# EAGLE schematic SegmentDriver (EAGLE 7.7.0)

## Sheet 1 of 10: Power
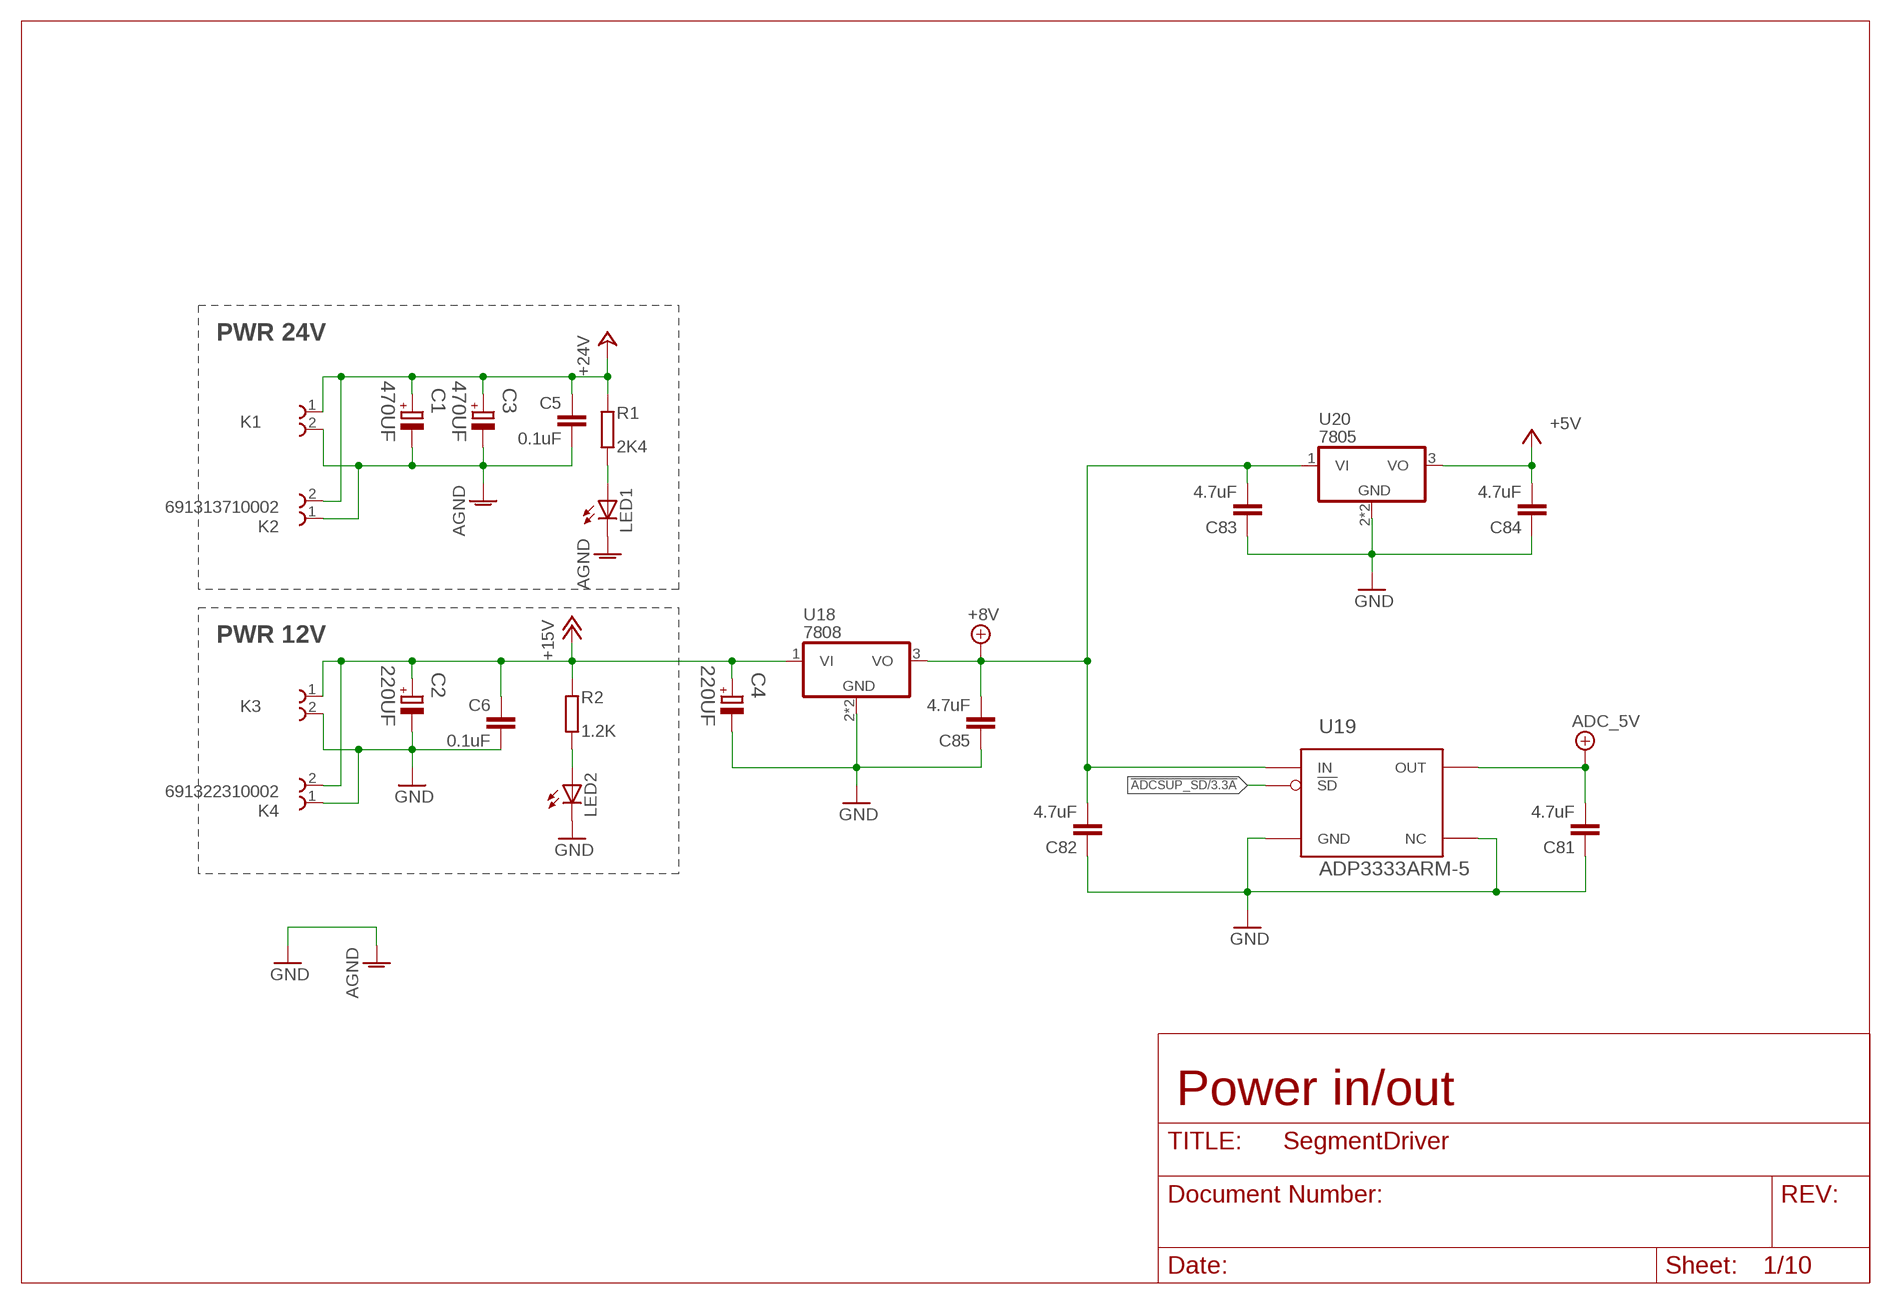
[diagram p0: schematic, sheet 1]

### Parts
C1  470UF  EEE-FK1J471AM-CASE-J16  [CAPAE1700X1700N]
C2  220UF  EEE-FP1V221AP-CASE-F  [CAPAE830X1050N]
C3  470UF  EEE-FK1J471AM-CASE-J16  [CAPAE1700X1700N]
C4  220UF  EEE-FP1V221AP-CASE-F  [CAPAE830X1050N]
C5  0.1uF  C-EUC0603K  [C0603K]
C6  0.1uF  C-EUC0603K  [C0603K]
C81  4.7uF  C-EUC0603K  [C0603K]
C82  4.7uF  C-EUC0805K  [C0805K]
C83  4.7uF  C-EUC0805K  [C0805K]
C84  4.7uF  C-EUC0603K  [C0603K]
C85  4.7uF  C-EUC0805K  [C0805K]
K1  691313710002  [691313710002]
K2  691313710002  [691313710002]
K3  691322310002  [691322310002]
K4  691322310002  [691322310002]
LED1  LEDCHIPLED_0603  [CHIPLED_0603]
LED2  LEDCHIPLED_0603  [CHIPLED_0603]
R1  2K4  R-EU_R0603  [R0603]
R2  1.2K  R-EU_R0603  [R0603]
U18  7808  78XXKTTR-D2PACK  [D2PACK/A]
U19  ADP3333ARM-5  [MSOP-8]
U20  7805  78XXKTTR-D2PACK  [D2PACK/A]

### Nets
!ADCSUP_SD: U19.7(!SD!) ; also sheet 3
+5V: C84.2 U20.3(VO) ; also sheet 2,5,9,10
+8V: C82.2 C83.2 C85.2 U18.3(VO) U19.2(IN) U20.1(VI)
+15V: C2.1 C4.1 C6.2 K3.1 K4.2 R2.2 U18.1(VI) ; also sheet 6
+24V: C1.1 C3.1 C5.2 K1.1 K2.2 R1.2 ; also sheet 6
ADC_5V: C81.2 U19.1(OUT) ; also sheet 7
AGND: C1.2 C3.2 C5.1 K1.2 K2.1 LED1.C ; also sheet 6
GND: C2.2 C4.2 C6.1 C81.1 C82.1 C83.1 C84.1 C85.1 K3.2 K4.1 LED2.C U18.2(GND) U18.TAB(GND) U19.3(GND) U19.4(NC) U19.5(NC) U19.6(NC) U19.8(NC) U20.2(GND) U20.TAB(GND) ; supply symbol labelled AGND ; also sheet 2,3,4,5,6,7,8,9,10
N$62: LED2.A R2.1
N$63: LED1.A R1.1

### Notes on the sheet
- PWR 24V
- PWR 12V
- Power in/out

## Sheet 2 of 10: Connectors
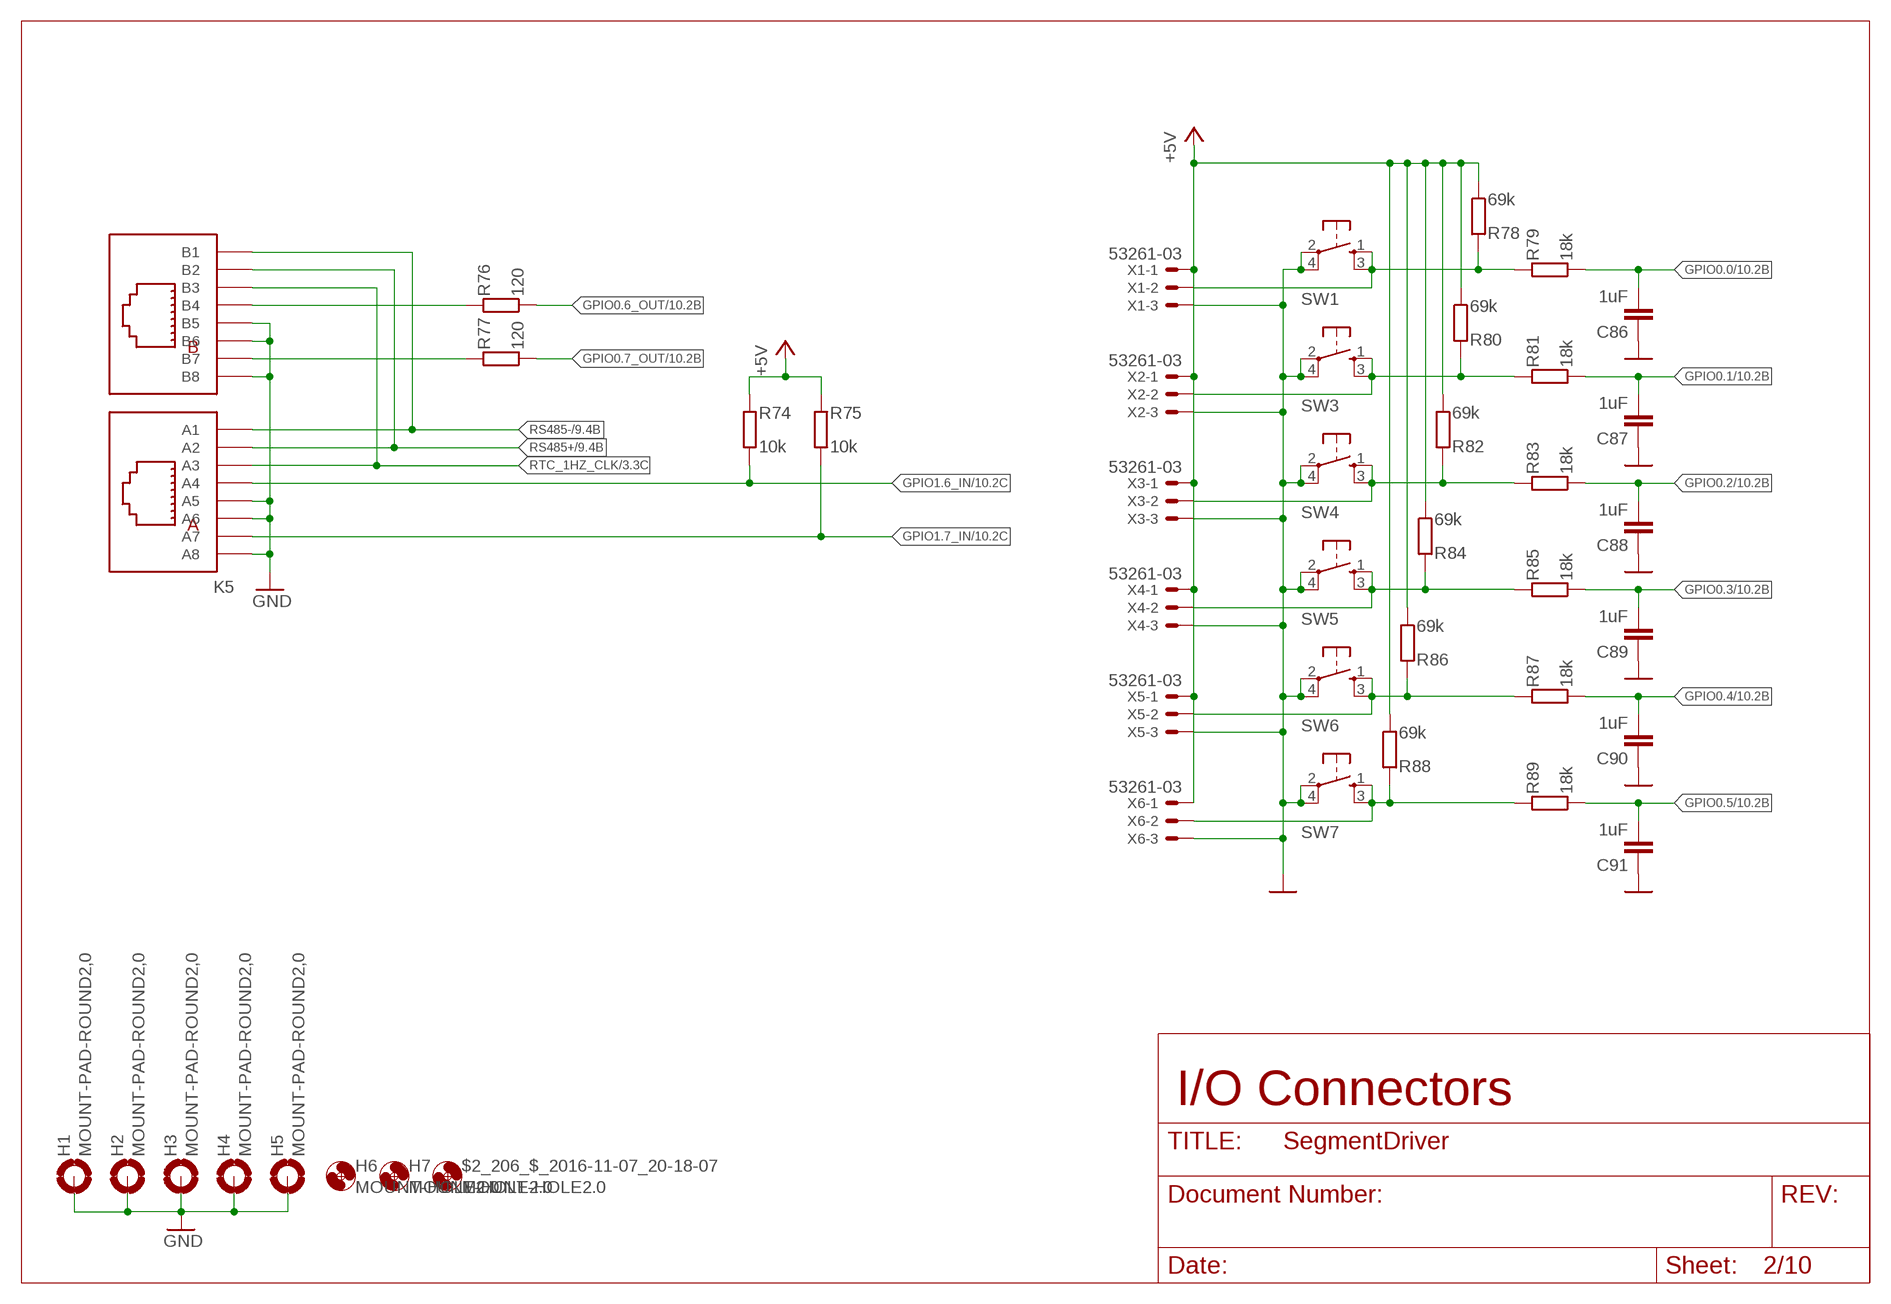
[diagram p1: schematic, sheet 2]

### Parts
$2_206_$_2016-11-07_20-18-07  MOUNT-HOLE2.0  [2,0]
C86  1uF  C-EUC0603K  [C0603K]
C87  1uF  C-EUC0603K  [C0603K]
C88  1uF  C-EUC0603K  [C0603K]
C89  1uF  C-EUC0603K  [C0603K]
C90  1uF  C-EUC0603K  [C0603K]
C91  1uF  C-EUC0603K  [C0603K]
H1  MOUNT-PAD-ROUND2,0  [2,0-PAD]
H2  MOUNT-PAD-ROUND2,0  [2,0-PAD]
H3  MOUNT-PAD-ROUND2,0  [2,0-PAD]
H4  MOUNT-PAD-ROUND2,0  [2,0-PAD]
H5  MOUNT-PAD-ROUND2,0  [2,0-PAD]
H6  MOUNT-HOLE2.0  [2,0]
H7  MOUNT-HOLE2.0  [2,0]
K5  615016149521  [615016149521]
R74  10k  R-EU_R0603  [R0603]
R75  10k  R-EU_R0603  [R0603]
R76  120  R-EU_R0603  [R0603]
R77  120  R-EU_R0603  [R0603]
R78  69k  R-EU_R0603  [R0603]
R79  18k  R-EU_R0603  [R0603]
R80  69k  R-EU_R0603  [R0603]
R81  18k  R-EU_R0603  [R0603]
R82  69k  R-EU_R0603  [R0603]
R83  18k  R-EU_R0603  [R0603]
R84  69k  R-EU_R0603  [R0603]
R85  18k  R-EU_R0603  [R0603]
R86  69k  R-EU_R0603  [R0603]
R87  18k  R-EU_R0603  [R0603]
R88  69k  R-EU_R0603  [R0603]
R89  18k  R-EU_R0603  [R0603]
SW1  434153017835_FIXED  [434153017835]
SW3  434153017835_FIXED  [434153017835]
SW4  434153017835_FIXED  [434153017835]
SW5  434153017835_FIXED  [434153017835]
SW6  434153017835_FIXED  [434153017835]
SW7  434153017835_FIXED  [434153017835]
X1  53261-03  [53261-03]
X2  53261-03  [53261-03]
X3  53261-03  [53261-03]
X4  53261-03  [53261-03]
X5  53261-03  [53261-03]
X6  53261-03  [53261-03]

### Nets
+5V: R74.2 R75.2 R78.1 R80.1 R82.1 R84.1 R86.1 R88.1 X1.1 X2.1 X3.1 X4.1 X5.1 X6.1 ; also sheet 1,5,9,10
GND: C86.1 C87.1 C88.1 C89.1 C90.1 C91.1 H1.B2,2(MOUNT) H2.B2,2(MOUNT) H3.B2,2(MOUNT) H4.B2,2(MOUNT) H5.B2,2(MOUNT) K5.A5 K5.A6 K5.A8 K5.B5 K5.B6 K5.B8 SW1.2 SW1.4 SW3.2 SW3.4 SW4.2 SW4.4 SW5.2 SW5.4 SW6.2 SW6.4 SW7.2 SW7.4 X1.3 X2.3 X3.3 X4.3 X5.3 X6.3 ; also sheet 1,3,4,5,6,7,8,9,10
GPIO0.0: C86.2 R79.1 ; also sheet 10
GPIO0.1: C87.2 R81.1 ; also sheet 10
GPIO0.2: C88.2 R83.1 ; also sheet 10
GPIO0.3: C89.2 R85.1 ; also sheet 10
GPIO0.4: C90.2 R87.1 ; also sheet 10
GPIO0.5: C91.2 R89.1 ; also sheet 10
GPIO0.6_OUT: R76.1 ; also sheet 10
GPIO0.7_OUT: R77.1 ; also sheet 10
GPIO1.6_IN: K5.A4 R74.1 ; also sheet 10
GPIO1.7_IN: K5.A7 R75.1 ; also sheet 10
GPIO6_OUT: K5.B4 R76.2
GPIO7_OUT: K5.B7 R77.2
N$64: R78.2 R79.2 SW1.1 SW1.3 X1.2
N$66: R80.2 R81.2 SW3.1 SW3.3 X2.2
N$68: R82.2 R83.2 SW4.1 SW4.3 X3.2
N$70: R84.2 R85.2 SW5.1 SW5.3 X4.2
N$72: R86.2 R87.2 SW6.1 SW6.3 X5.2
N$79: R88.2 R89.2 SW7.1 SW7.3 X6.2
RS485+: K5.A2 K5.B2 ; also sheet 9
RS485-: K5.A1 K5.B1 ; also sheet 9
RTC_1HZ_CLK: K5.A3 K5.B3 ; also sheet 3,4

### Notes on the sheet
- I/O Connectors

## Sheet 3 of 10: MCU
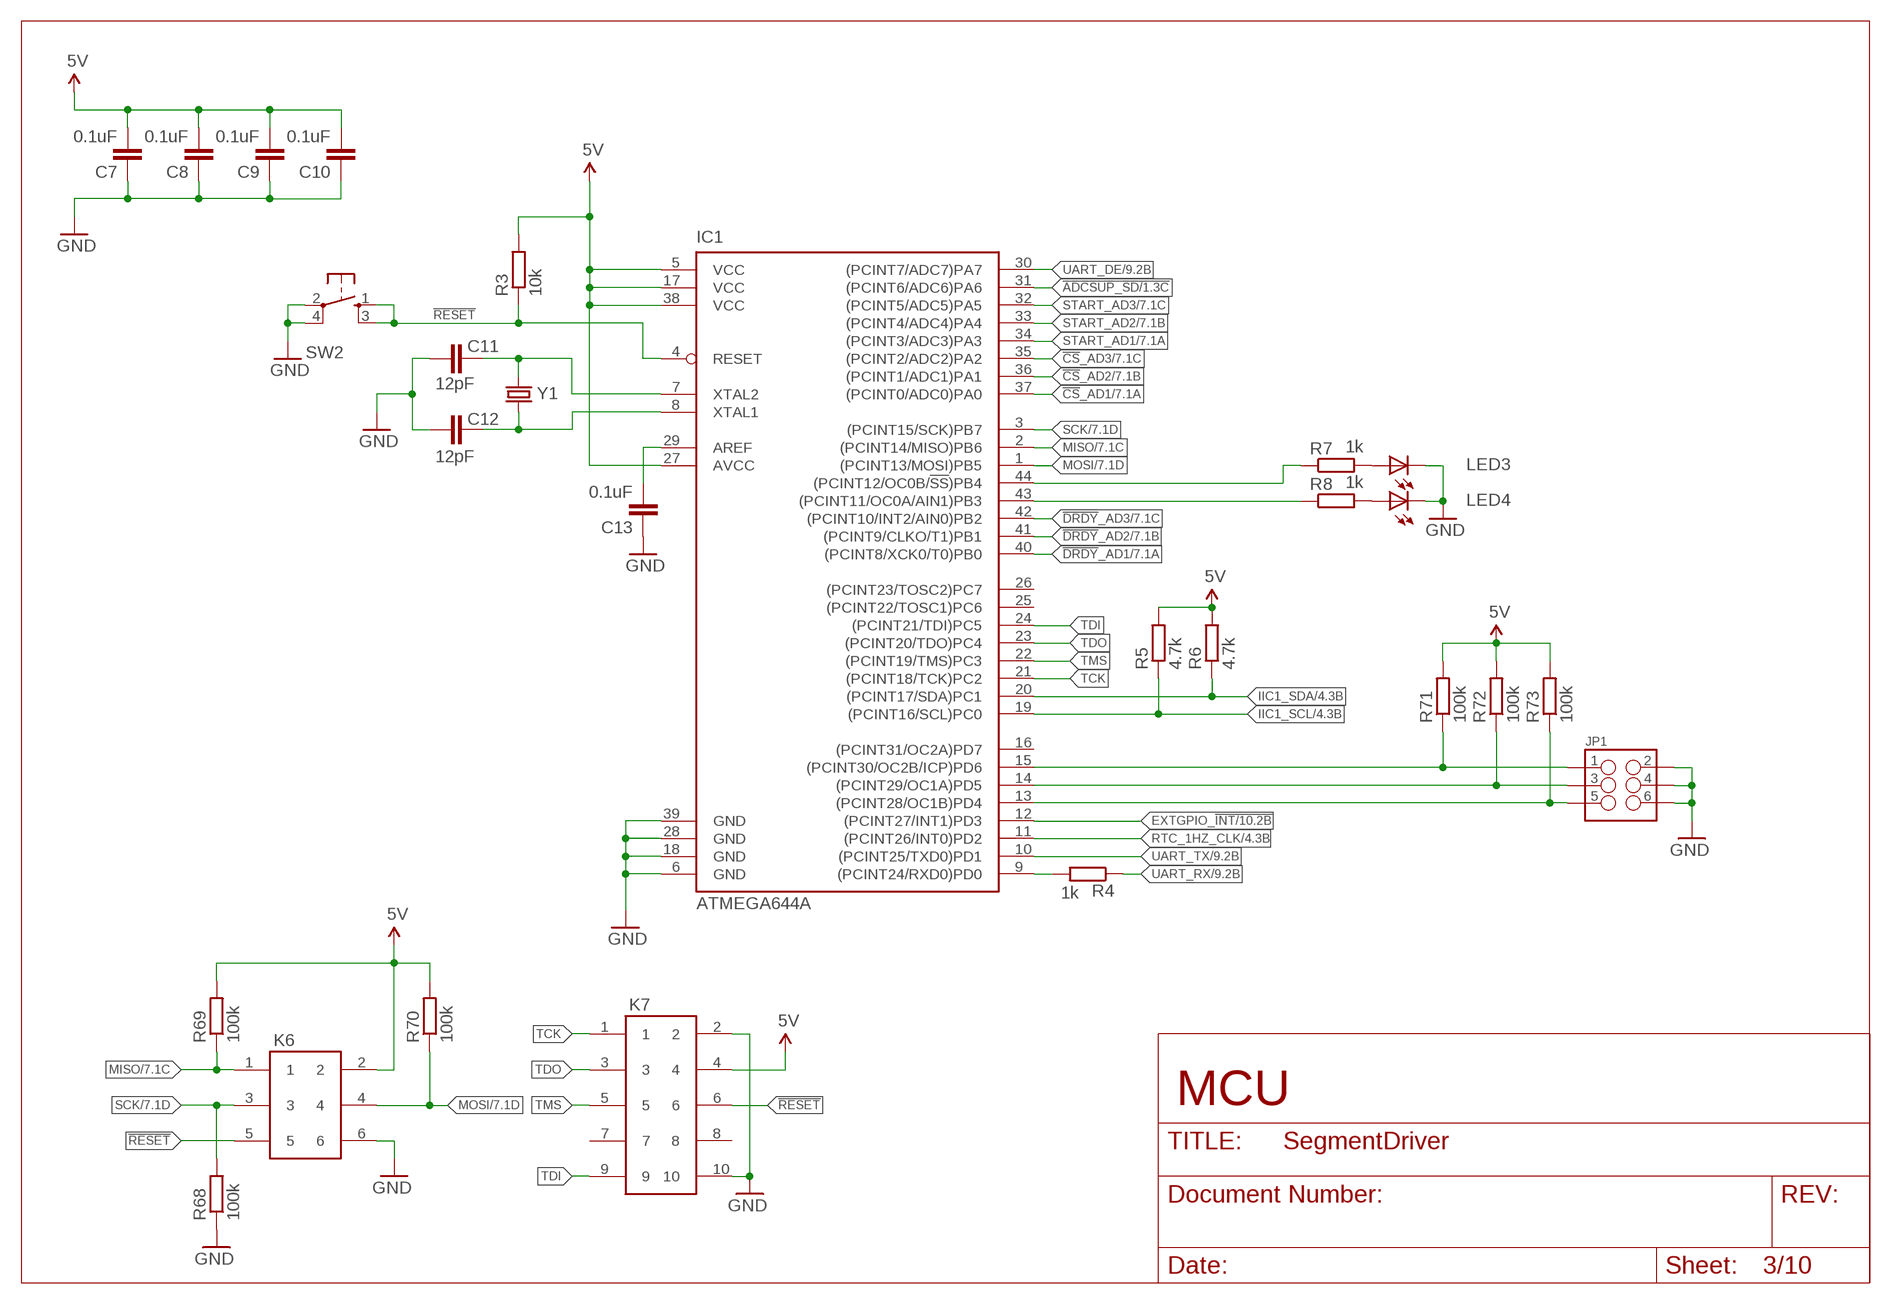
[diagram p2: schematic, sheet 3]

### Parts
C7  0.1uF  C-EUC0603K  [C0603K]
C8  0.1uF  C-EUC0603K  [C0603K]
C9  0.1uF  C-EUC0603K  [C0603K]
C10  0.1uF  C-EUC0603K  [C0603K]
C11  12pF  C-EUC0603K  [C0603K]
C12  12pF  C-EUC0603K  [C0603K]
C13  0.1uF  C-EUC0603K  [C0603K]
IC1  ATMEGA644A  [TQFP44]
JP1  M03X22X3_SILK_SM  [2X3]
K6  61200621621  [61200621621]
K7  61201021621  [61201021621]
LED3  LEDCHIPLED_0603  [CHIPLED_0603]
LED4  LEDCHIPLED_0603  [CHIPLED_0603]
R3  10k  R-EU_R0603  [R0603]
R4  1k  R-EU_R0603  [R0603]
R5  4.7k  R-EU_R0603  [R0603]
R6  4.7k  R-EU_R0603  [R0603]
R7  1k  R-EU_R0603  [R0603]
R8  1k  R-EU_R0603  [R0603]
R68  100k  R-EU_R0603  [R0603]
R69  100k  R-EU_R0603  [R0603]
R70  100k  R-EU_R0603  [R0603]
R71  100k  R-EU_R0603  [R0603]
R72  100k  R-EU_R0603  [R0603]
R73  100k  R-EU_R0603  [R0603]
SW2  434153017835_FIXED  [434153017835]
Y1  CRYSTAL5X3  [CRYSTAL-SMD-5X3]

### Nets
5V: C7.2 C8.2 C9.2 C10.2 IC1.5(VCC) IC1.17(VCC) IC1.27(AVCC) IC1.38(VCC) K6.2 K7.4 R3.2 R5.2 R6.2 R69.2 R70.2 R71.2 R72.2 R73.2 ; also sheet 4
!ADCSUP_SD: IC1.31((PCINT6/ADC6)PA6) ; also sheet 1
!CS!_AD1: IC1.37((PCINT0/ADC0)PA0) ; also sheet 7
!CS!_AD2: IC1.36((PCINT1/ADC1)PA1) ; also sheet 7
!CS!_AD3: IC1.35((PCINT2/ADC2)PA2) ; also sheet 7
!DRDY!_AD1: IC1.40((PCINT8/XCK0/T0)PB0) ; also sheet 7
!DRDY!_AD2: IC1.41((PCINT9/CLKO/T1)PB1) ; also sheet 7
!DRDY!_AD3: IC1.42((PCINT10/INT2/AIN0)PB2) ; also sheet 7
!RESET: IC1.4(RESET) K6.5 K7.6 R3.1 SW2.1 SW2.3
EXTGPIO_!INT: IC1.12((PCINT27/INT1)PD3) ; also sheet 10
GND: C7.1 C8.1 C9.1 C10.1 C11.2 C12.2 C13.1 IC1.6(GND) IC1.18(GND) IC1.28(GND) IC1.39(GND) JP1.2 JP1.4 JP1.6 K6.6 K7.2 K7.10 LED3.C LED4.C R68.1 SW2.2 SW2.4 ; also sheet 1,2,4,5,6,7,8,9,10
IIC1_SCL: IC1.19((PCINT16/SCL)PC0) R5.1 ; also sheet 4,5,10
IIC1_SDA: IC1.20((PCINT17/SDA)PC1) R6.1 ; also sheet 4,5,10
LED1: IC1.44((PCINT12/OC0B/!SS!)PB4) R7.1
MISO: IC1.2((PCINT14/MISO)PB6) K6.1 R69.1 ; also sheet 7
MOSI: IC1.1((PCINT13/MOSI)PB5) K6.4 R70.1 ; also sheet 7
N$29: C13.2 IC1.29(AREF)
N$32: LED4.A R8.2
N$33: LED3.A R7.2
N$39: C12.1 IC1.8(XTAL1) Y1.1
N$40: C11.1 IC1.7(XTAL2) Y1.3
N$47: IC1.9((PCINT24/RXD0)PD0) R4.2
N$56: IC1.13((PCINT28/OC1B)PD4) JP1.5 R73.1
N$57: IC1.14((PCINT29/OC1A)PD5) JP1.3 R72.1
N$58: IC1.15((PCINT30/OC2B/ICP)PD6) JP1.1 R71.1
N$59: IC1.43((PCINT11/OC0A/AIN1)PB3) R8.1
RTC_1HZ_CLK: IC1.11((PCINT26/INT0)PD2) ; also sheet 2,4
SCK: IC1.3((PCINT15/SCK)PB7) K6.3 R68.2 ; also sheet 7
START_AD1: IC1.34((PCINT3/ADC3)PA3) ; also sheet 7
START_AD2: IC1.33((PCINT4/ADC4)PA4) ; also sheet 7
START_AD3: IC1.32((PCINT5/ADC5)PA5) ; also sheet 7
TCK: IC1.21((PCINT18/TCK)PC2) K7.1
TDI: IC1.24((PCINT21/TDI)PC5) K7.9
TDO: IC1.23((PCINT20/TDO)PC4) K7.3
TMS: IC1.22((PCINT19/TMS)PC3) K7.5
UART_DE: IC1.30((PCINT7/ADC7)PA7) ; also sheet 9
UART_RX: R4.1 ; also sheet 9
UART_TX: IC1.10((PCINT25/TXD0)PD1) ; also sheet 9
Unconnected: IC1.16((PCINT31/OC2A)PD7) IC1.25((PCINT22/TOSC1)PC6) IC1.26((PCINT23/TOSC2)PC7) K7.7 K7.8

### Notes on the sheet
- MCU

## Sheet 4 of 10: RTC
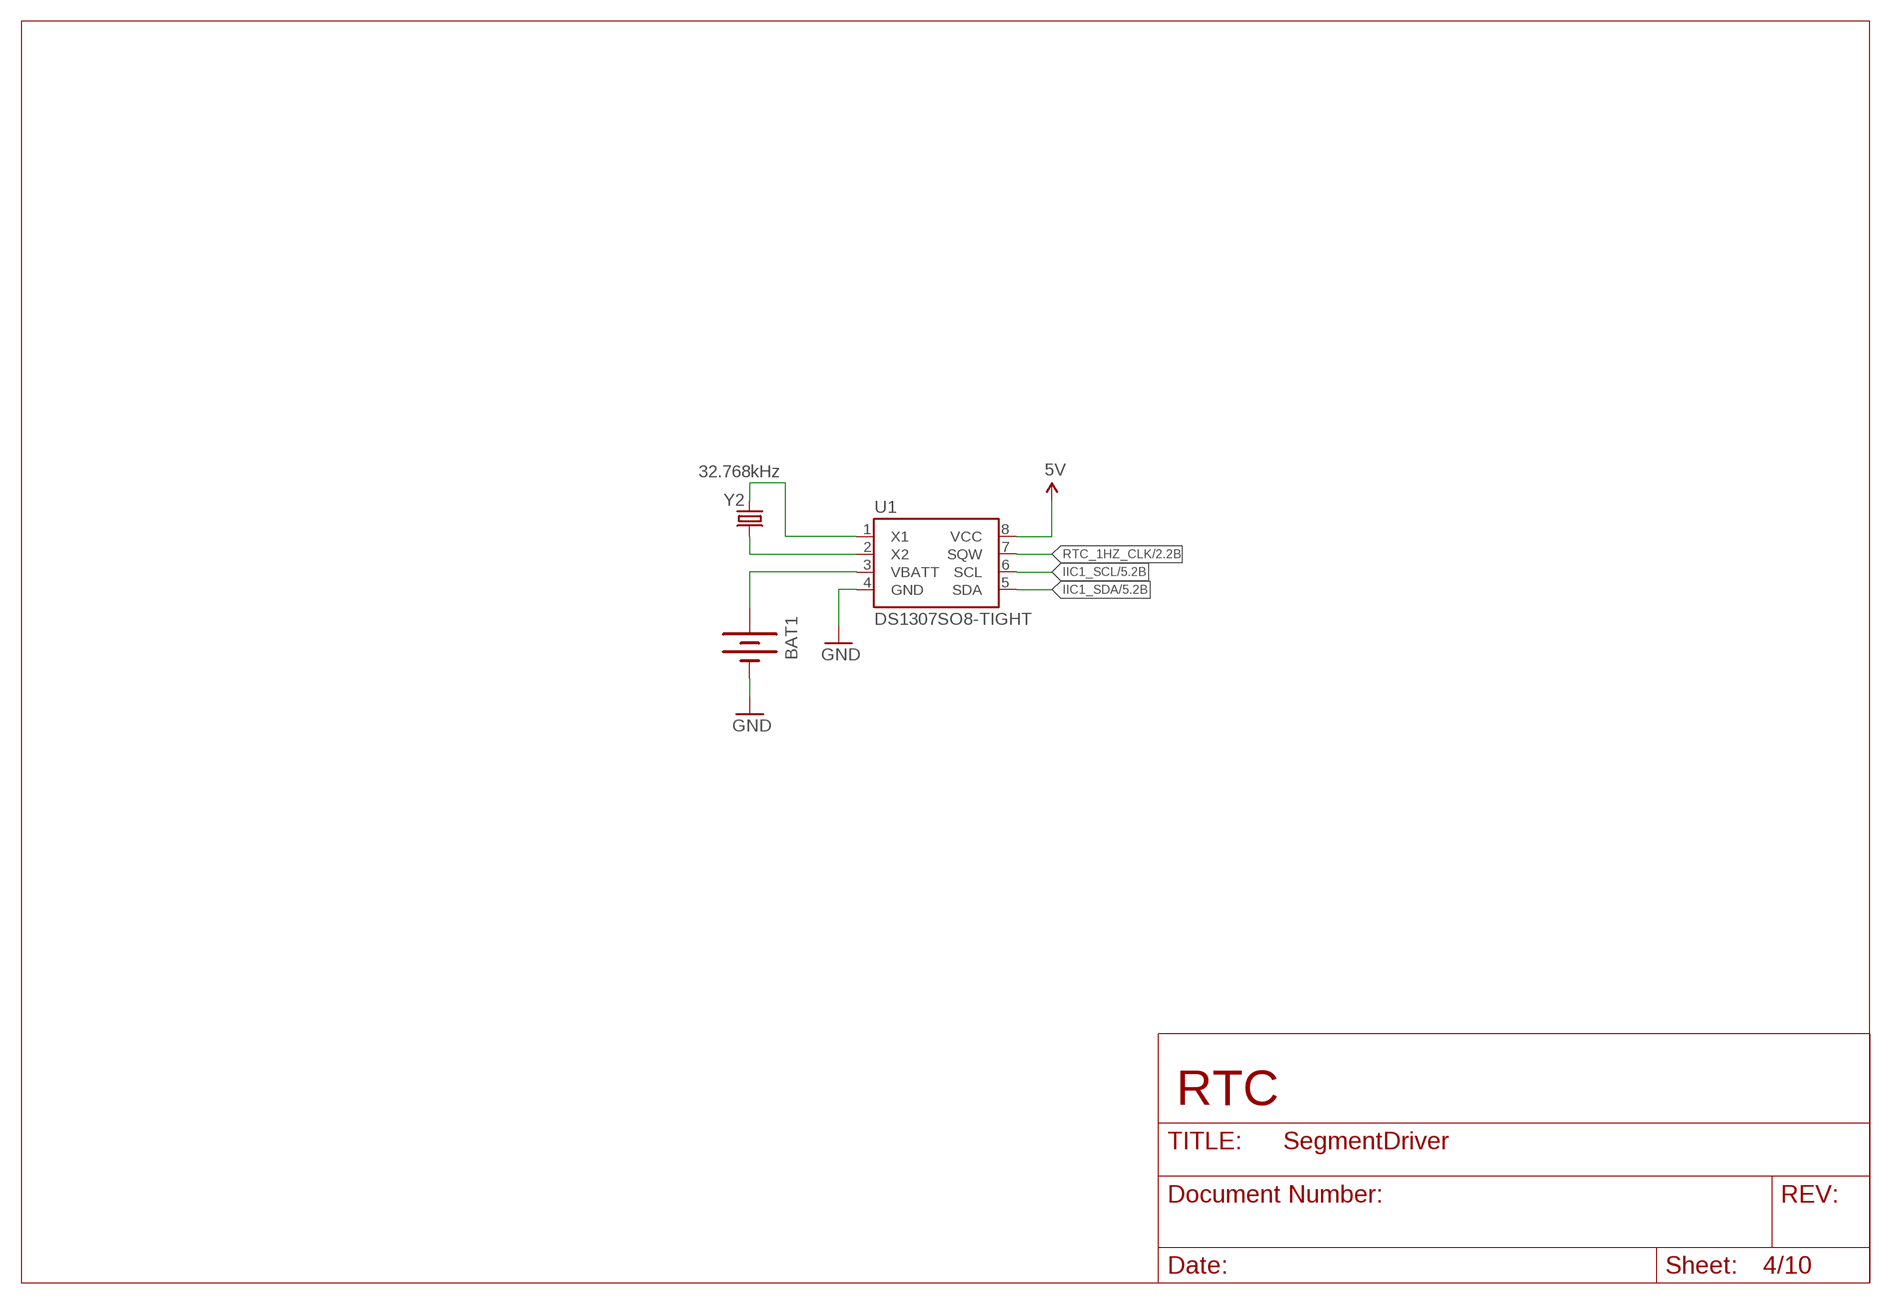
[diagram p3: schematic, sheet 4]

### Parts
BAT1  BATTERY-79528211  [79528211]
U1  DS1307SO8-TIGHT  [SO08-TIGHT]
Y2  32.768kHz  CRYSTALEPSONMC146  [CRYSTAL-32KHZ-SMD_EPSON_MC146]

### Nets
5V: U1.8(VCC) ; also sheet 3
GND: BAT1.- U1.4(GND) ; also sheet 1,2,3,5,6,7,8,9,10
IIC1_SCL: U1.6(SCL) ; also sheet 3,5,10
IIC1_SDA: U1.5(SDA) ; also sheet 3,5,10
N$21: U1.2(X2) Y2.P$2
N$24: BAT1.+ U1.3(VBATT)
RTC_1HZ_CLK: U1.7(SQW) ; also sheet 2,3
X1: U1.1(X1) Y2.P$1

### Notes on the sheet
- RTC

## Sheet 5 of 10: Heater PWM control
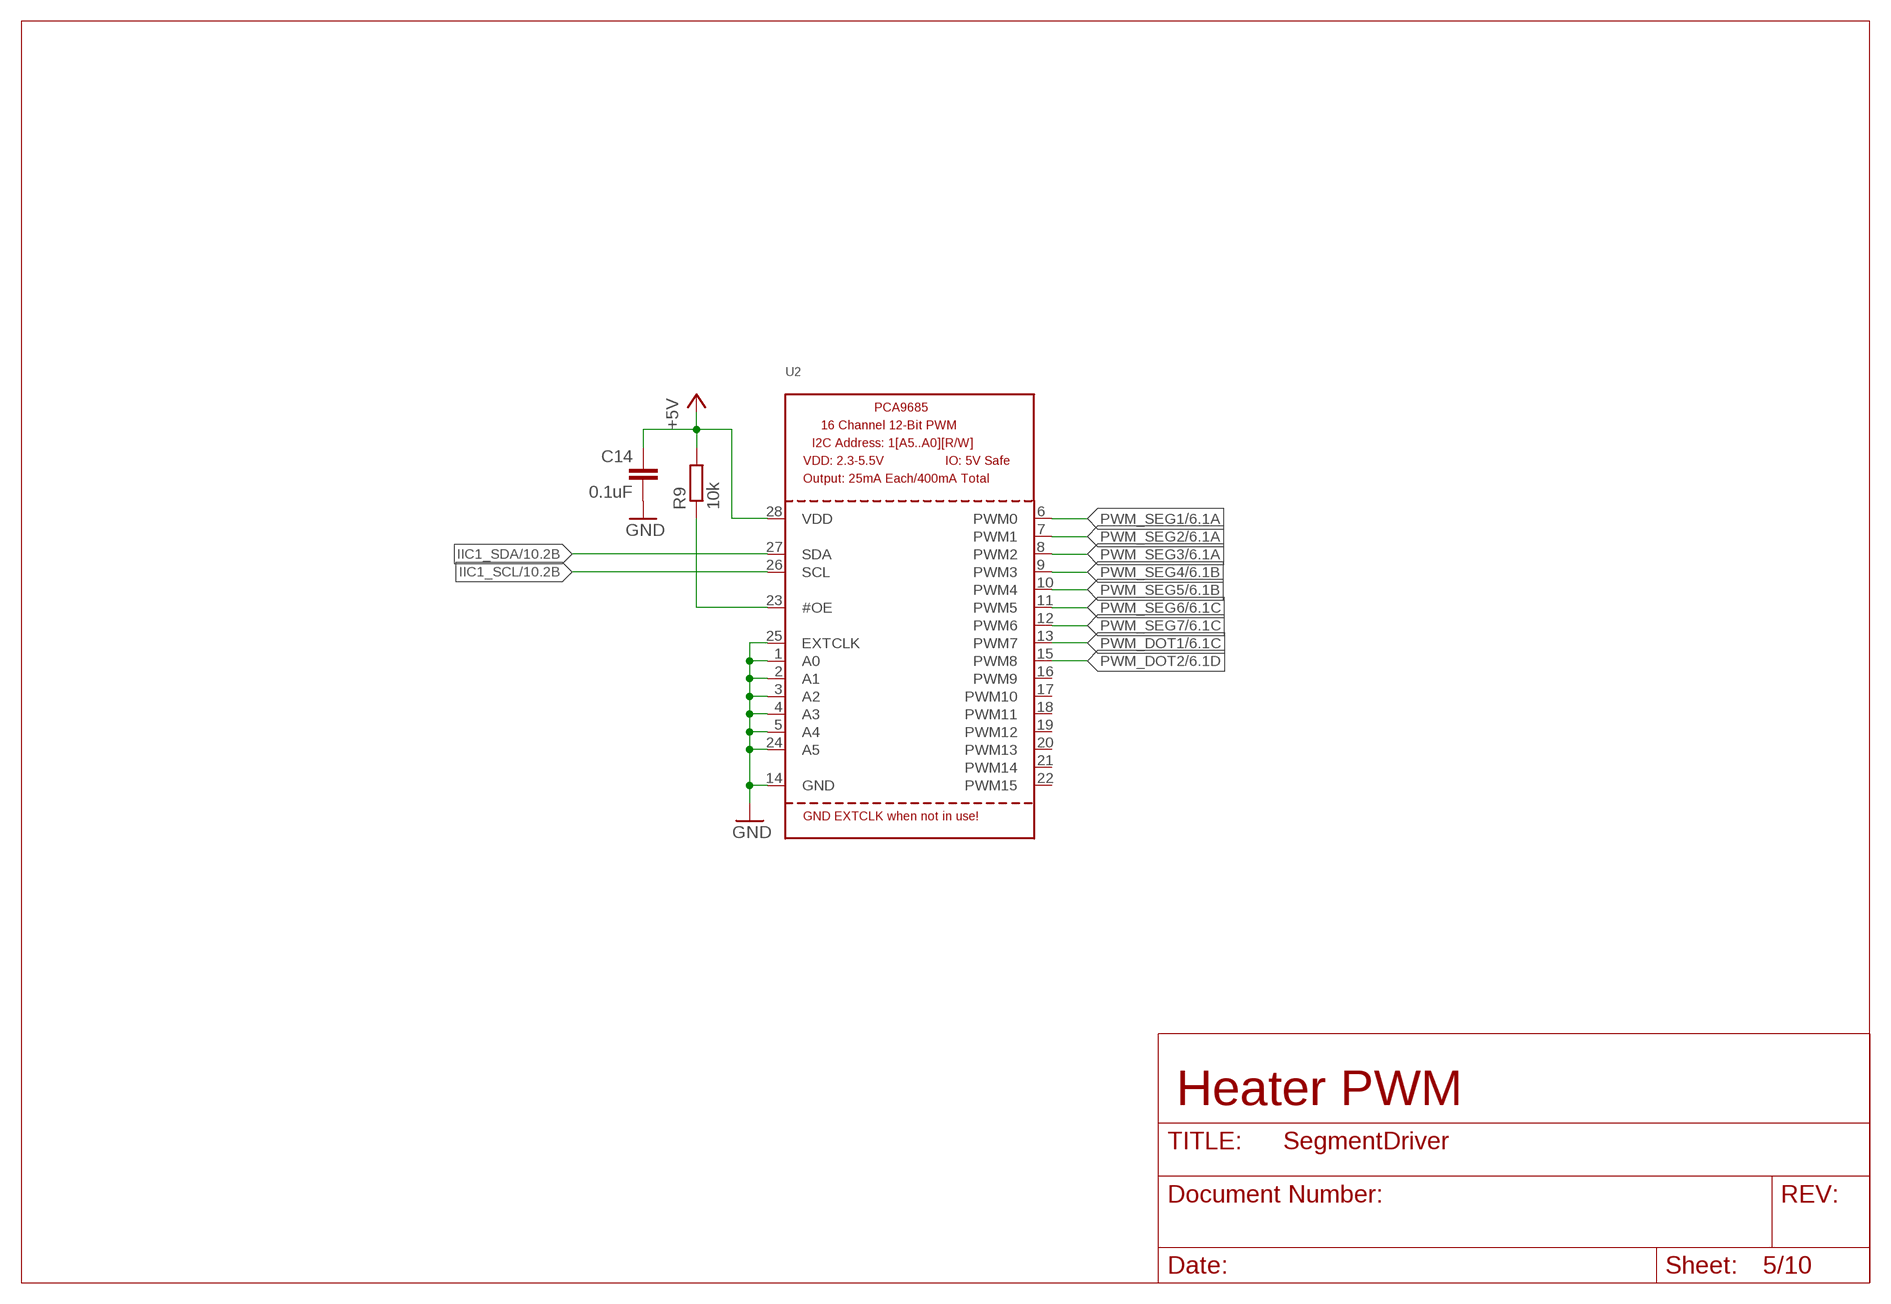
[diagram p4: schematic, sheet 5]

### Parts
C14  0.1uF  C-EUC0603K  [C0603K]
R9  10k  R-EU_R0603  [R0603]
U2  PCA9685  [TSSOP28]

### Nets
+5V: C14.1 R9.2 U2.28(VDD) ; also sheet 1,2,9,10
GND: C14.2 U2.1(A0) U2.2(A1) U2.3(A2) U2.4(A3) U2.5(A4) U2.14(GND) U2.24(A5) U2.25(EXTCLK) ; also sheet 1,2,3,4,6,7,8,9,10
IIC1_SCL: U2.26(SCL) ; also sheet 3,4,10
IIC1_SDA: U2.27(SDA) ; also sheet 3,4,10
N$5: R9.1 U2.23(#OE)
PWM_DOT1: U2.13(PWM7) ; also sheet 6
PWM_DOT2: U2.15(PWM8) ; also sheet 6
PWM_SEG1: U2.6(PWM0) ; also sheet 6
PWM_SEG2: U2.7(PWM1) ; also sheet 6
PWM_SEG3: U2.8(PWM2) ; also sheet 6
PWM_SEG4: U2.9(PWM3) ; also sheet 6
PWM_SEG5: U2.10(PWM4) ; also sheet 6
PWM_SEG6: U2.11(PWM5) ; also sheet 6
PWM_SEG7: U2.12(PWM6) ; also sheet 6
Unconnected: U2.16(PWM9) U2.17(PWM10) U2.18(PWM11) U2.19(PWM12) U2.20(PWM13) U2.21(PWM14) U2.22(PWM15)

### Notes on the sheet
- Heater PWM

## Sheet 6 of 10: Segment heaters
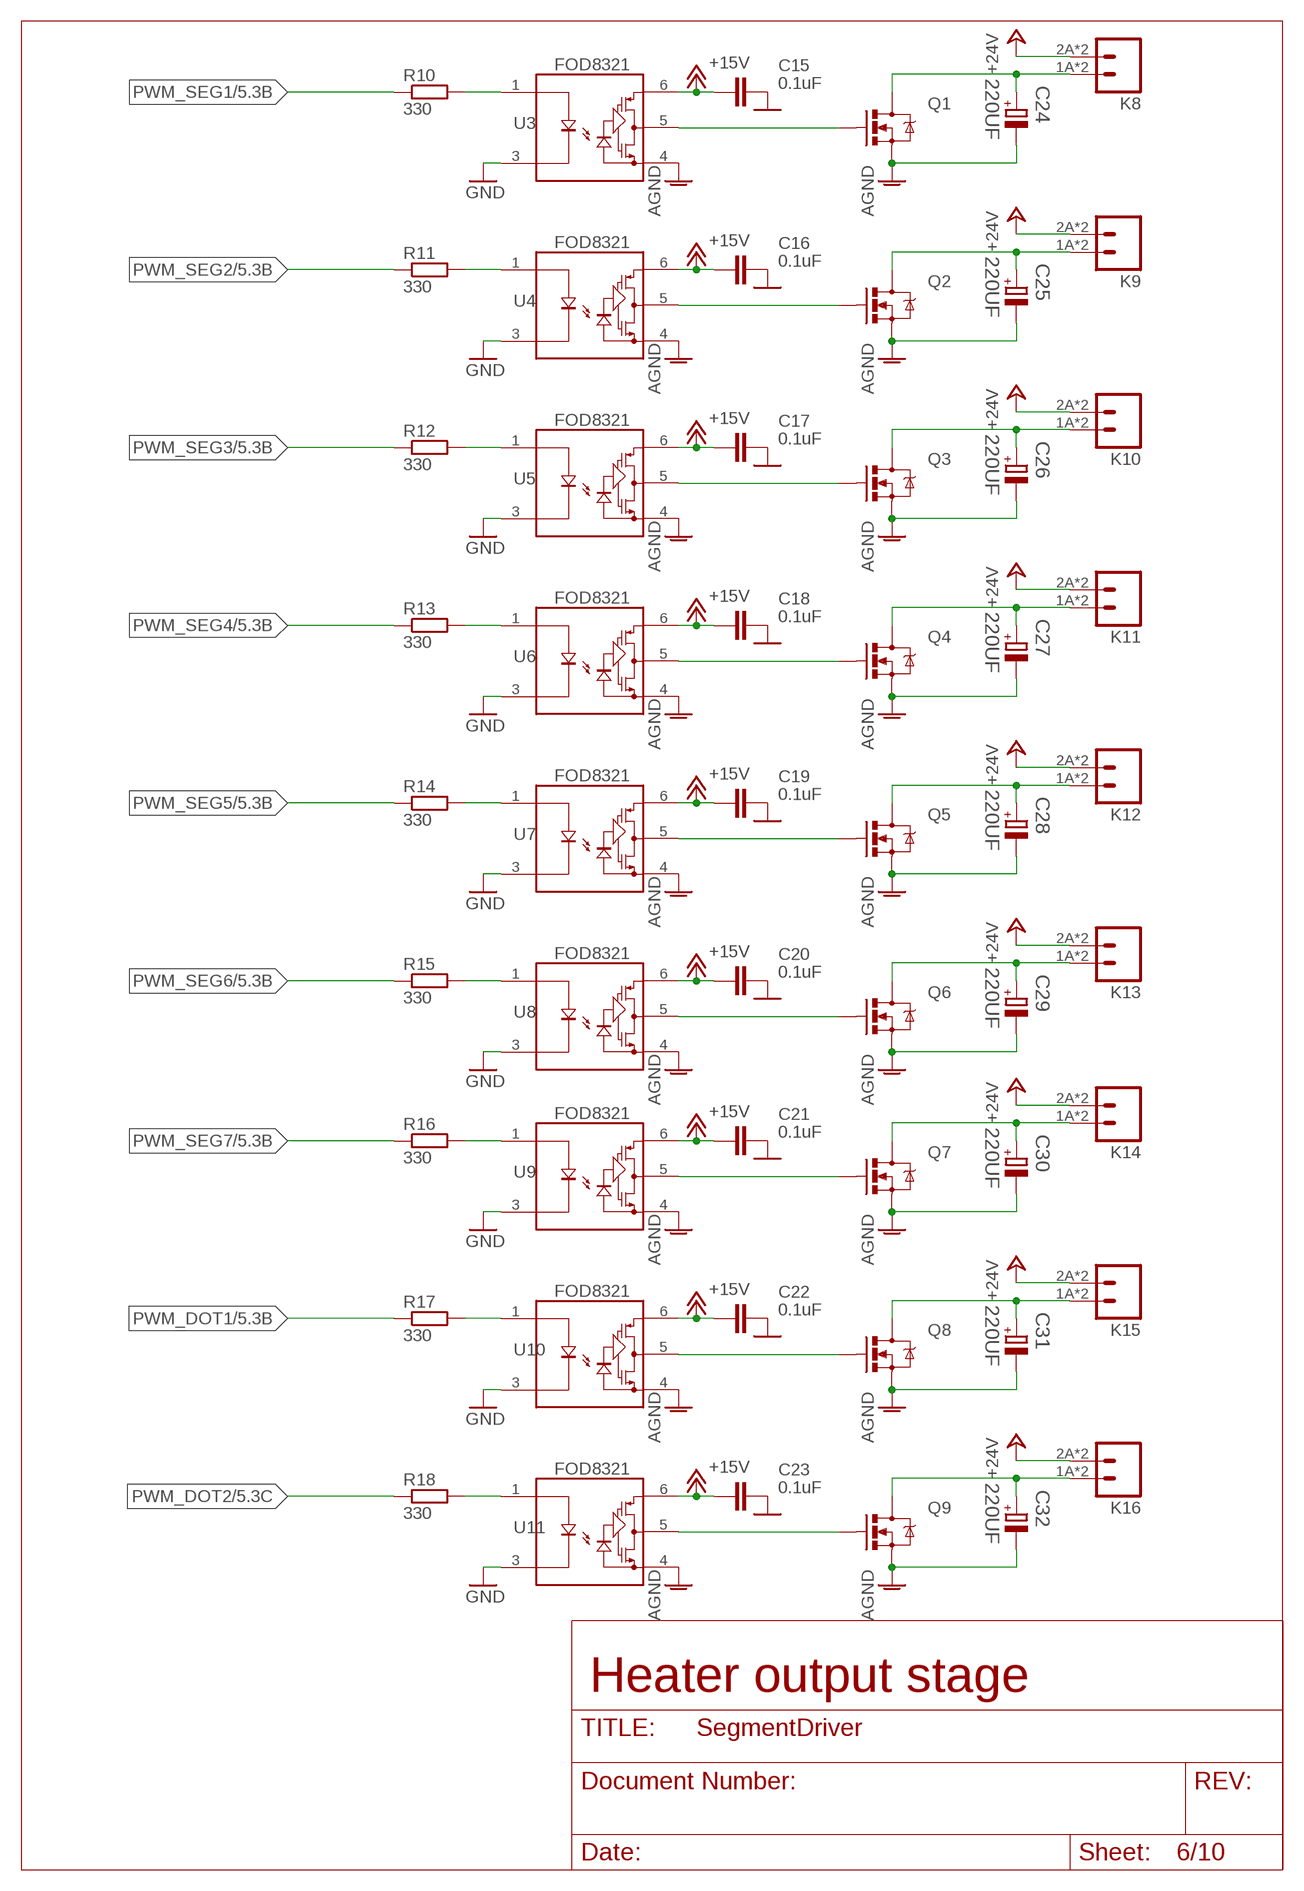
[diagram p5: schematic, sheet 6]

### Parts
C15  0.1uF  C-EUC1206K  [C1206K]
C16  0.1uF  C-EUC1206K  [C1206K]
C17  0.1uF  C-EUC1206K  [C1206K]
C18  0.1uF  C-EUC1206K  [C1206K]
C19  0.1uF  C-EUC1206K  [C1206K]
C20  0.1uF  C-EUC1206K  [C1206K]
C21  0.1uF  C-EUC1206K  [C1206K]
C22  0.1uF  C-EUC1206K  [C1206K]
C23  0.1uF  C-EUC1206K  [C1206K]
C24  220UF  EEE-FK1J221AQ-CASE-H13  [CAPAE1350X1400N]
C25  220UF  EEE-FK1J221AQ-CASE-H13  [CAPAE1350X1400N]
C26  220UF  EEE-FK1J221AQ-CASE-H13  [CAPAE1350X1400N]
C27  220UF  EEE-FK1J221AQ-CASE-H13  [CAPAE1350X1400N]
C28  220UF  EEE-FK1J221AQ-CASE-H13  [CAPAE1350X1400N]
C29  220UF  EEE-FK1J221AQ-CASE-H13  [CAPAE1350X1400N]
C30  220UF  EEE-FK1J221AQ-CASE-H13  [CAPAE1350X1400N]
C31  220UF  EEE-FK1J221AQ-CASE-H13  [CAPAE1350X1400N]
C32  220UF  EEE-FK1J221AQ-CASE-H13  [CAPAE1350X1400N]
K8  M02-MOLEX-104188-0210  [LITE-TRAP-CONNECTOR-2]
K9  M02-MOLEX-104188-0210  [LITE-TRAP-CONNECTOR-2]
K10  M02-MOLEX-104188-0210  [LITE-TRAP-CONNECTOR-2]
K11  M02-MOLEX-104188-0210  [LITE-TRAP-CONNECTOR-2]
K12  M02-MOLEX-104188-0210  [LITE-TRAP-CONNECTOR-2]
K13  M02-MOLEX-104188-0210  [LITE-TRAP-CONNECTOR-2]
K14  M02-MOLEX-104188-0210  [LITE-TRAP-CONNECTOR-2]
K15  M02-MOLEX-104188-0210  [LITE-TRAP-CONNECTOR-2]
K16  M02-MOLEX-104188-0210  [LITE-TRAP-CONNECTOR-2]
Q1  MOSFET-NCHANNEL-FDMS5672  [POWERPACK5060-8]
Q2  MOSFET-NCHANNEL-FDMS5672  [POWERPACK5060-8]
Q3  MOSFET-NCHANNEL-FDMS5672  [POWERPACK5060-8]
Q4  MOSFET-NCHANNEL-FDMS5672  [POWERPACK5060-8]
Q5  MOSFET-NCHANNEL-FDMS5672  [POWERPACK5060-8]
Q6  MOSFET-NCHANNEL-FDMS5672  [POWERPACK5060-8]
Q7  MOSFET-NCHANNEL-FDMS5672  [POWERPACK5060-8]
Q8  MOSFET-NCHANNEL-FDMS5672  [POWERPACK5060-8]
Q9  MOSFET-NCHANNEL-FDMS5672  [POWERPACK5060-8]
R10  330  R-EU_R0603  [R0603]
R11  330  R-EU_R0603  [R0603]
R12  330  R-EU_R0603  [R0603]
R13  330  R-EU_R0603  [R0603]
R14  330  R-EU_R0603  [R0603]
R15  330  R-EU_R0603  [R0603]
R16  330  R-EU_R0603  [R0603]
R17  330  R-EU_R0603  [R0603]
R18  330  R-EU_R0603  [R0603]
U3  FOD8321  [WB-SOP5]
U4  FOD8321  [WB-SOP5]
U5  FOD8321  [WB-SOP5]
U6  FOD8321  [WB-SOP5]
U7  FOD8321  [WB-SOP5]
U8  FOD8321  [WB-SOP5]
U9  FOD8321  [WB-SOP5]
U10  FOD8321  [WB-SOP5]
U11  FOD8321  [WB-SOP5]

### Nets
+15V: C15.1 C16.1 C17.1 C18.1 C19.1 C20.1 C21.1 C22.1 C23.1 U3.6(VDD) U4.6(VDD) U5.6(VDD) U6.6(VDD) U7.6(VDD) U8.6(VDD) U9.6(VDD) U10.6(VDD) U11.6(VDD) ; also sheet 1
+24V: K8.2A K8.2B K9.2A K9.2B K10.2A K10.2B K11.2A K11.2B K12.2A K12.2B K13.2A K13.2B K14.2A K14.2B K15.2A K15.2B K16.2A K16.2B ; also sheet 1
AGND: C24.2 C25.2 C26.2 C27.2 C28.2 C29.2 C30.2 C31.2 C32.2 Q1.S1(S) Q1.S2(S) Q1.S3(S) Q2.S1(S) Q2.S2(S) Q2.S3(S) Q3.S1(S) Q3.S2(S) Q3.S3(S) Q4.S1(S) Q4.S2(S) Q4.S3(S) Q5.S1(S) Q5.S2(S) Q5.S3(S) Q6.S1(S) Q6.S2(S) Q6.S3(S) Q7.S1(S) Q7.S2(S) Q7.S3(S) Q8.S1(S) Q8.S2(S) Q8.S3(S) Q9.S1(S) Q9.S2(S) Q9.S3(S) U3.4(VSS) U4.4(VSS) U5.4(VSS) U6.4(VSS) U7.4(VSS) U8.4(VSS) U9.4(VSS) U10.4(VSS) U11.4(VSS) ; also sheet 1
GND: C15.2 C16.2 C17.2 C18.2 C19.2 C20.2 C21.2 C22.2 C23.2 U3.3(K) U4.3(K) U5.3(K) U6.3(K) U7.3(K) U8.3(K) U9.3(K) U10.3(K) U11.3(K) ; also sheet 1,2,3,4,5,7,8,9,10
N$1: R18.2 U11.1(A)
N$2: R17.2 U10.1(A)
N$3: C24.1 K8.1A K8.1B Q1.D5(D) Q1.D6(D) Q1.D7(D) Q1.D8(D) Q1.DPAD(D)
N$4: R11.2 U4.1(A)
N$6: C25.1 K9.1A K9.1B Q2.D5(D) Q2.D6(D) Q2.D7(D) Q2.D8(D) Q2.DPAD(D)
N$7: R12.2 U5.1(A)
N$8: C26.1 K10.1A K10.1B Q3.D5(D) Q3.D6(D) Q3.D7(D) Q3.D8(D) Q3.DPAD(D)
N$9: R13.2 U6.1(A)
N$10: R10.2 U3.1(A)
N$11: C27.1 K11.1A K11.1B Q4.D5(D) Q4.D6(D) Q4.D7(D) Q4.D8(D) Q4.DPAD(D)
N$12: R14.2 U7.1(A)
N$13: C28.1 K12.1A K12.1B Q5.D5(D) Q5.D6(D) Q5.D7(D) Q5.D8(D) Q5.DPAD(D)
N$14: R15.2 U8.1(A)
N$15: C29.1 K13.1A K13.1B Q6.D5(D) Q6.D6(D) Q6.D7(D) Q6.D8(D) Q6.DPAD(D)
N$16: R16.2 U9.1(A)
N$17: C30.1 K14.1A K14.1B Q7.D5(D) Q7.D6(D) Q7.D7(D) Q7.D8(D) Q7.DPAD(D)
N$18: C31.1 K15.1A K15.1B Q8.D5(D) Q8.D6(D) Q8.D7(D) Q8.D8(D) Q8.DPAD(D)
N$19: C32.1 K16.1A K16.1B Q9.D5(D) Q9.D6(D) Q9.D7(D) Q9.D8(D) Q9.DPAD(D)
PWM_DOT1: R17.1 ; also sheet 5
PWM_DOT2: R18.1 ; also sheet 5
PWM_SEG1: R10.1 ; also sheet 5
PWM_SEG2: R11.1 ; also sheet 5
PWM_SEG3: R12.1 ; also sheet 5
PWM_SEG4: R13.1 ; also sheet 5
PWM_SEG5: R14.1 ; also sheet 5
PWM_SEG6: R15.1 ; also sheet 5
PWM_SEG7: R16.1 ; also sheet 5
VO: Q1.G4(G) U3.5(VO)
VO1: Q2.G4(G) U4.5(VO)
VO2: Q3.G4(G) U5.5(VO)
VO3: Q4.G4(G) U6.5(VO)
VO4: Q5.G4(G) U7.5(VO)
VO5: Q6.G4(G) U8.5(VO)
VO6: Q7.G4(G) U9.5(VO)
VO7: Q9.G4(G) U11.5(VO)
VO8: Q8.G4(G) U10.5(VO)

### Notes on the sheet
- Heater output stage

## Sheet 7 of 10: RTD ADS
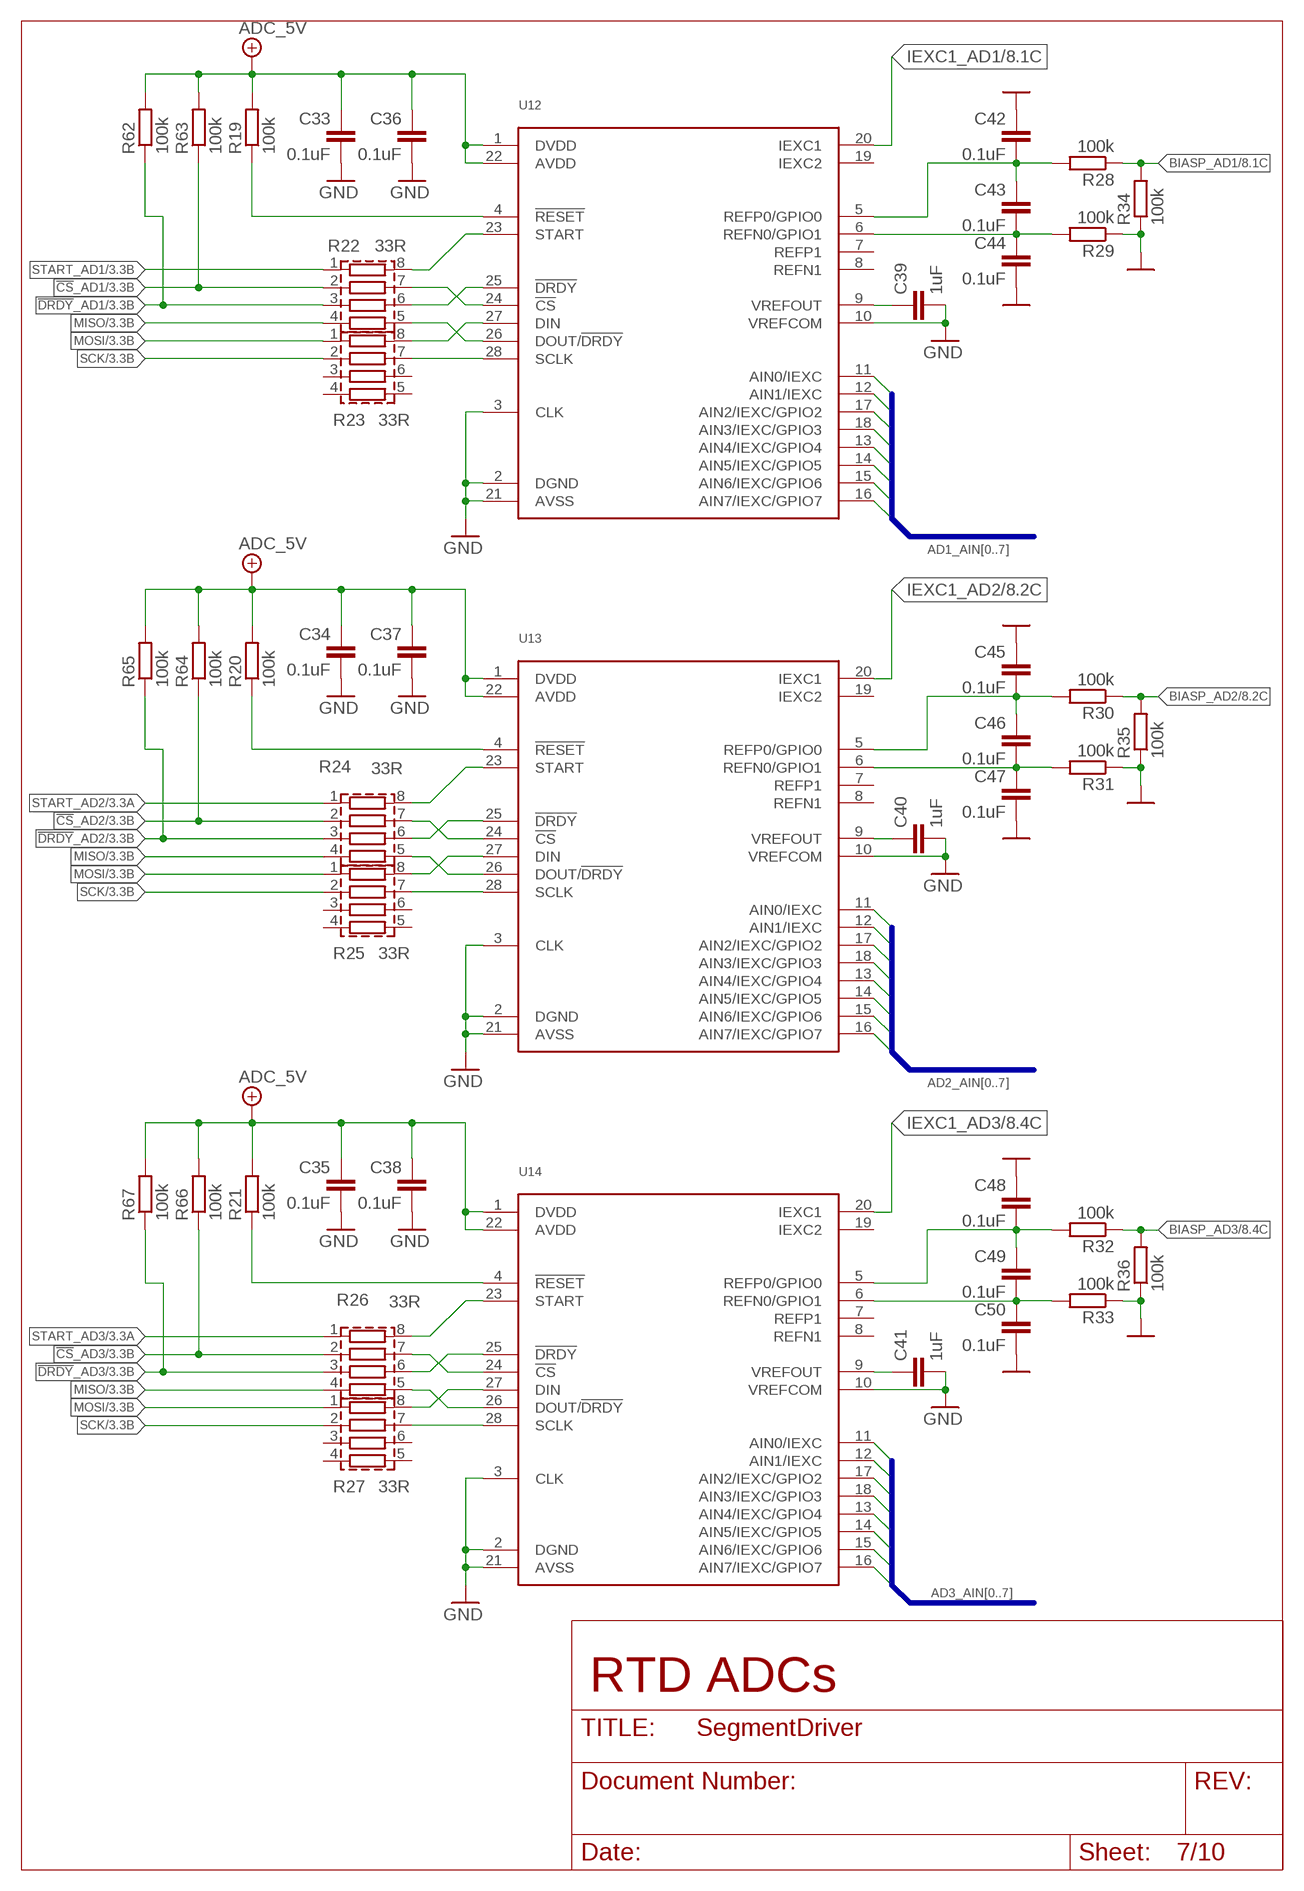
[diagram p6: schematic, sheet 7]

### Parts
C33  0.1uF  C-EUC0603K  [C0603K]
C34  0.1uF  C-EUC0603K  [C0603K]
C35  0.1uF  C-EUC0603K  [C0603K]
C36  0.1uF  C-EUC0603K  [C0603K]
C37  0.1uF  C-EUC0603K  [C0603K]
C38  0.1uF  C-EUC0603K  [C0603K]
C39  1uF  C-EUC0603K  [C0603K]
C40  1uF  C-EUC0603K  [C0603K]
C41  1uF  C-EUC0603K  [C0603K]
C42  0.1uF  C-EUC0603K  [C0603K]
C43  0.1uF  C-EUC0603K  [C0603K]
C44  0.1uF  C-EUC0603K  [C0603K]
C45  0.1uF  C-EUC0603K  [C0603K]
C46  0.1uF  C-EUC0603K  [C0603K]
C47  0.1uF  C-EUC0603K  [C0603K]
C48  0.1uF  C-EUC0603K  [C0603K]
C49  0.1uF  C-EUC0603K  [C0603K]
C50  0.1uF  C-EUC0603K  [C0603K]
R19  100k  R-EU_R0603  [R0603]
R20  100k  R-EU_R0603  [R0603]
R21  100k  R-EU_R0603  [R0603]
R22  33R  EXBV8V330JV  [RESCAV80P320X160X70-8N]
R23  33R  EXBV8V330JV  [RESCAV80P320X160X70-8N]
R24  33R  EXBV8V330JV  [RESCAV80P320X160X70-8N]
R25  33R  EXBV8V330JV  [RESCAV80P320X160X70-8N]
R26  33R  EXBV8V330JV  [RESCAV80P320X160X70-8N]
R27  33R  EXBV8V330JV  [RESCAV80P320X160X70-8N]
R28  100k  R-EU_R0603  [R0603]
R29  100k  R-EU_R0603  [R0603]
R30  100k  R-EU_R0603  [R0603]
R31  100k  R-EU_R0603  [R0603]
R32  100k  R-EU_R0603  [R0603]
R33  100k  R-EU_R0603  [R0603]
R34  100k  R-EU_R0603  [R0603]
R35  100k  R-EU_R0603  [R0603]
R36  100k  R-EU_R0603  [R0603]
R62  100k  R-EU_R0603  [R0603]
R63  100k  R-EU_R0603  [R0603]
R64  100k  R-EU_R0603  [R0603]
R65  100k  R-EU_R0603  [R0603]
R66  100k  R-EU_R0603  [R0603]
R67  100k  R-EU_R0603  [R0603]
U12  ADS1X48IPW  [TSSOP28]
U13  ADS1X48IPW  [TSSOP28]
U14  ADS1X48IPW  [TSSOP28]

### Nets
9_AD1: C39.1 U12.9(VREFOUT)
9_AD2: C40.1 U13.9(VREFOUT)
9_AD3: C41.1 U14.9(VREFOUT)
23_AD1: R22.8 U12.23(START)
23_AD2: R24.8 U13.23(START)
23_AD3: R26.8 U14.23(START)
24_AD1: R22.7 U12.24(!CS!)
24_AD2: R24.7 U13.24(!CS!)
24_AD3: R26.7 U14.24(!CS!)
25_AD1: R22.6 U12.25(!DRDY!)
25_AD2: R24.6 U13.25(!DRDY!)
25_AD3: R26.6 U14.25(!DRDY!)
26_AD1: R22.5 U12.26(DOUT/!DRDY!)
26_AD2: R24.5 U13.26(DOUT/!DRDY!)
26_AD3: R26.5 U14.26(DOUT/!DRDY!)
27_AD1: R23.8 U12.27(DIN)
27_AD2: R25.8 U13.27(DIN)
27_AD3: R27.8 U14.27(DIN)
28_AD1: R23.7 U12.28(SCLK)
28_AD2: R25.7 U13.28(SCLK)
28_AD3: R27.7 U14.28(SCLK)
!CS!_AD1: R22.2 R63.1 ; also sheet 3
!CS!_AD2: R24.2 R64.1 ; also sheet 3
!CS!_AD3: R26.2 R66.1 ; also sheet 3
!DRDY!_AD1: R22.3 R62.1 ; also sheet 3
!DRDY!_AD2: R24.3 R65.1 ; also sheet 3
!DRDY!_AD3: R26.3 R67.1 ; also sheet 3
!RESET!_AD1: R19.1 U12.4(!RESET!)
!RESET!_AD2: R20.1 U13.4(!RESET!)
!RESET!_AD3: R21.1 U14.4(!RESET!)
AD1_AIN0: U12.11(AIN0/IEXC) ; also sheet 8
AD1_AIN1: U12.12(AIN1/IEXC) ; also sheet 8
AD1_AIN2: U12.17(AIN2/IEXC/GPIO2) ; also sheet 8
AD1_AIN3: U12.18(AIN3/IEXC/GPIO3) ; also sheet 8
AD1_AIN4: U12.13(AIN4/IEXC/GPIO4) ; also sheet 8
AD1_AIN5: U12.14(AIN5/IEXC/GPIO5) ; also sheet 8
AD1_AIN6: U12.15(AIN6/IEXC/GPIO6) ; also sheet 8
AD1_AIN7: U12.16(AIN7/IEXC/GPIO7) ; also sheet 8
AD2_AIN0: U13.11(AIN0/IEXC) ; also sheet 8
AD2_AIN1: U13.12(AIN1/IEXC) ; also sheet 8
AD2_AIN2: U13.17(AIN2/IEXC/GPIO2) ; also sheet 8
AD2_AIN3: U13.18(AIN3/IEXC/GPIO3) ; also sheet 8
AD2_AIN4: U13.13(AIN4/IEXC/GPIO4) ; also sheet 8
AD2_AIN5: U13.14(AIN5/IEXC/GPIO5) ; also sheet 8
AD2_AIN6: U13.15(AIN6/IEXC/GPIO6) ; also sheet 8
AD2_AIN7: U13.16(AIN7/IEXC/GPIO7) ; also sheet 8
AD3_AIN0: U14.11(AIN0/IEXC) ; also sheet 8
AD3_AIN1: U14.12(AIN1/IEXC) ; also sheet 8
AD3_AIN2: U14.17(AIN2/IEXC/GPIO2) ; also sheet 8
AD3_AIN3: U14.18(AIN3/IEXC/GPIO3) ; also sheet 8
AD3_AIN4: U14.13(AIN4/IEXC/GPIO4) ; also sheet 8
AD3_AIN5: U14.14(AIN5/IEXC/GPIO5) ; also sheet 8
AD3_AIN6: U14.15(AIN6/IEXC/GPIO6) ; also sheet 8
AD3_AIN7: U14.16(AIN7/IEXC/GPIO7) ; also sheet 8
ADC_5V: C33.1 C34.1 C35.1 C36.1 C37.1 C38.1 R19.2 R20.2 R21.2 R62.2 R63.2 R64.2 R65.2 R66.2 R67.2 U12.1(DVDD) U12.22(AVDD) U13.1(DVDD) U13.22(AVDD) U14.1(DVDD) U14.22(AVDD) ; also sheet 1
BIASP_AD1: R28.1 R34.2 ; also sheet 8
BIASP_AD2: R30.1 R35.2 ; also sheet 8
BIASP_AD3: R32.1 R36.2 ; also sheet 8
GND: C33.2 C34.2 C35.2 C36.2 C37.2 C38.2 C39.2 C40.2 C41.2 C42.1 C44.2 C45.1 C47.2 C48.1 C50.2 R29.1 R31.1 R33.1 R34.1 R35.1 R36.1 U12.2(DGND) U12.3(CLK) U12.10(VREFCOM) U12.21(AVSS) U13.2(DGND) U13.3(CLK) U13.10(VREFCOM) U13.21(AVSS) U14.2(DGND) U14.3(CLK) U14.10(VREFCOM) U14.21(AVSS) ; also sheet 1,2,3,4,5,6,8,9,10
IEXC1_AD1: U12.20(IEXC1) ; also sheet 8
IEXC1_AD2: U13.20(IEXC1) ; also sheet 8
IEXC1_AD3: U14.20(IEXC1) ; also sheet 8
MISO: R22.4 R24.4 R26.4 ; also sheet 3
MOSI: R23.1 R25.1 R27.1 ; also sheet 3
REFN0_AD1: C43.2 C44.1 R29.2 U12.6(REFN0/GPIO1)
REFN0_AD2: C46.2 C47.1 R31.2 U13.6(REFN0/GPIO1)
REFN0_AD3: C49.2 C50.1 R33.2 U14.6(REFN0/GPIO1)
REFP0_AD1: C42.2 C43.1 R28.2 U12.5(REFP0/GPIO0)
REFP0_AD2: C45.2 C46.1 R30.2 U13.5(REFP0/GPIO0)
REFP0_AD3: C48.2 C49.1 R32.2 U14.5(REFP0/GPIO0)
SCK: R23.2 R25.2 R27.2 ; also sheet 3
START_AD1: R22.1 ; also sheet 3
START_AD2: R24.1 ; also sheet 3
START_AD3: R26.1 ; also sheet 3
Unconnected: R23.3 R23.4 R23.5 R23.6 R25.3 R25.4 R25.5 R25.6 R27.3 R27.4 R27.5 R27.6 U12.7(REFP1) U12.8(REFN1) U12.19(IEXC2) U13.7(REFP1) U13.8(REFN1) U13.19(IEXC2) U14.7(REFP1) U14.8(REFN1) U14.19(IEXC2)

### Buses
AD1_AIN[0..7]
AD2_AIN[0..7]
AD3_AIN[0..7]

### Notes on the sheet
- RTD ADCs

## Sheet 8 of 10: RTD Input & differential filtering
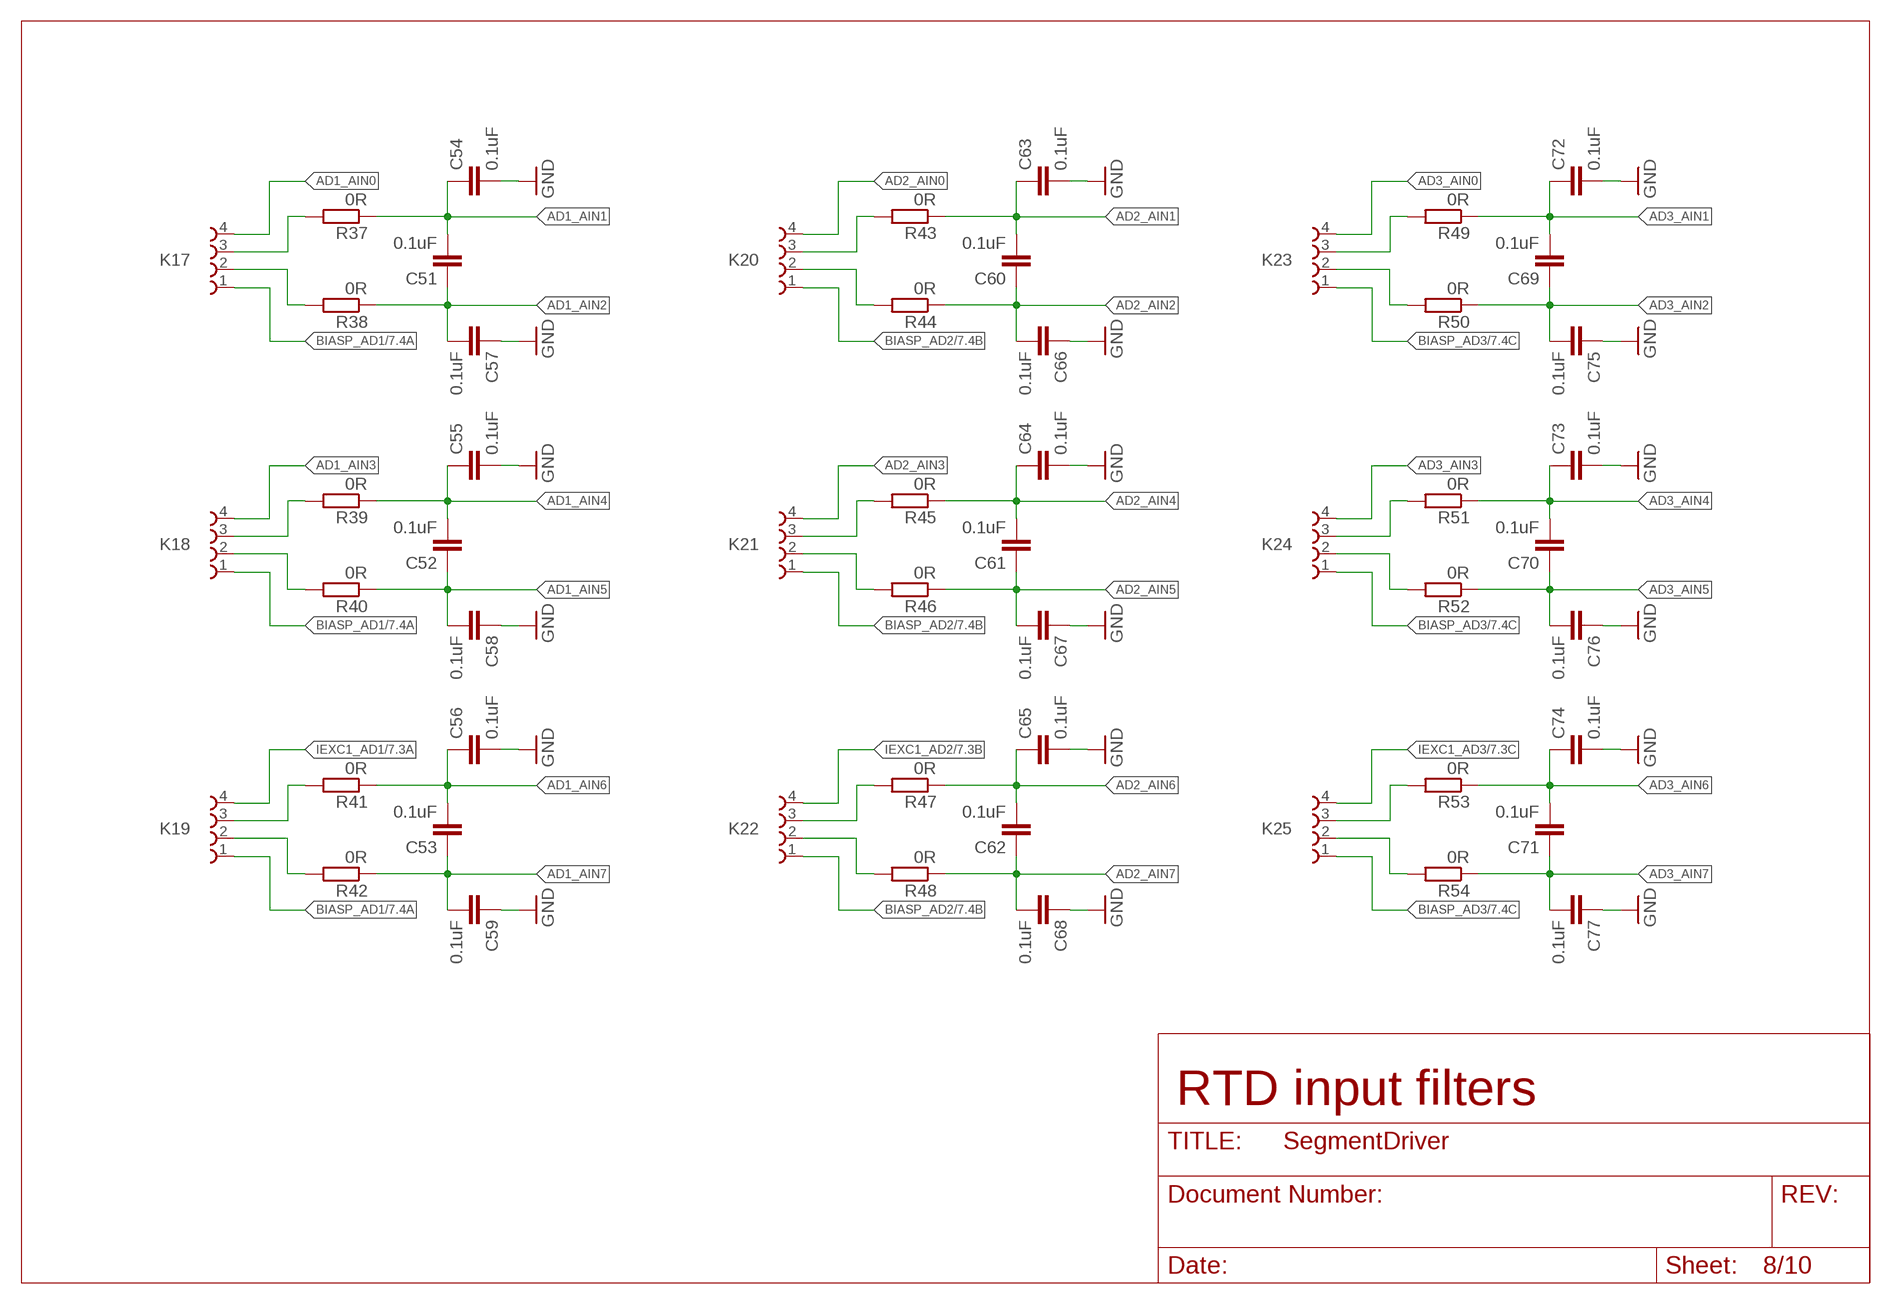
[diagram p7: schematic, sheet 8]

### Parts
C51  0.1uF  C-EUC0603K  [C0603K]
C52  0.1uF  C-EUC0603K  [C0603K]
C53  0.1uF  C-EUC0603K  [C0603K]
C54  0.1uF  C-EUC0603K  [C0603K]
C55  0.1uF  C-EUC0603K  [C0603K]
C56  0.1uF  C-EUC0603K  [C0603K]
C57  0.1uF  C-EUC0603K  [C0603K]
C58  0.1uF  C-EUC0603K  [C0603K]
C59  0.1uF  C-EUC0603K  [C0603K]
C60  0.1uF  C-EUC0603K  [C0603K]
C61  0.1uF  C-EUC0603K  [C0603K]
C62  0.1uF  C-EUC0603K  [C0603K]
C63  0.1uF  C-EUC0603K  [C0603K]
C64  0.1uF  C-EUC0603K  [C0603K]
C65  0.1uF  C-EUC0603K  [C0603K]
C66  0.1uF  C-EUC0603K  [C0603K]
C67  0.1uF  C-EUC0603K  [C0603K]
C68  0.1uF  C-EUC0603K  [C0603K]
C69  0.1uF  C-EUC0603K  [C0603K]
C70  0.1uF  C-EUC0603K  [C0603K]
C71  0.1uF  C-EUC0603K  [C0603K]
C72  0.1uF  C-EUC0603K  [C0603K]
C73  0.1uF  C-EUC0603K  [C0603K]
C74  0.1uF  C-EUC0603K  [C0603K]
C75  0.1uF  C-EUC0603K  [C0603K]
C76  0.1uF  C-EUC0603K  [C0603K]
C77  0.1uF  C-EUC0603K  [C0603K]
K17  691210910004  [691210910004]
K18  691210910004  [691210910004]
K19  691210910004  [691210910004]
K20  691210910004  [691210910004]
K21  691210910004  [691210910004]
K22  691210910004  [691210910004]
K23  691210910004  [691210910004]
K24  691210910004  [691210910004]
K25  691210910004  [691210910004]
R37  0R  R-EU_R0603  [R0603]
R38  0R  R-EU_R0603  [R0603]
R39  0R  R-EU_R0603  [R0603]
R40  0R  R-EU_R0603  [R0603]
R41  0R  R-EU_R0603  [R0603]
R42  0R  R-EU_R0603  [R0603]
R43  0R  R-EU_R0603  [R0603]
R44  0R  R-EU_R0603  [R0603]
R45  0R  R-EU_R0603  [R0603]
R46  0R  R-EU_R0603  [R0603]
R47  0R  R-EU_R0603  [R0603]
R48  0R  R-EU_R0603  [R0603]
R49  0R  R-EU_R0603  [R0603]
R50  0R  R-EU_R0603  [R0603]
R51  0R  R-EU_R0603  [R0603]
R52  0R  R-EU_R0603  [R0603]
R53  0R  R-EU_R0603  [R0603]
R54  0R  R-EU_R0603  [R0603]

### Nets
AD1_AIN0: K17.4 ; also sheet 7
AD1_AIN1: C51.2 C54.1 R37.1 ; also sheet 7
AD1_AIN2: C51.1 C57.2 R38.1 ; also sheet 7
AD1_AIN3: K18.4 ; also sheet 7
AD1_AIN4: C52.2 C55.1 R39.1 ; also sheet 7
AD1_AIN5: C52.1 C58.2 R40.1 ; also sheet 7
AD1_AIN6: C53.2 C56.1 R41.1 ; also sheet 7
AD1_AIN7: C53.1 C59.2 R42.1 ; also sheet 7
AD2_AIN0: K20.4 ; also sheet 7
AD2_AIN1: C60.2 C63.1 R43.1 ; also sheet 7
AD2_AIN2: C60.1 C66.2 R44.1 ; also sheet 7
AD2_AIN3: K21.4 ; also sheet 7
AD2_AIN4: C61.2 C64.1 R45.1 ; also sheet 7
AD2_AIN5: C61.1 C67.2 R46.1 ; also sheet 7
AD2_AIN6: C62.2 C65.1 R47.1 ; also sheet 7
AD2_AIN7: C62.1 C68.2 R48.1 ; also sheet 7
AD3_AIN0: K23.4 ; also sheet 7
AD3_AIN1: C69.2 C72.1 R49.1 ; also sheet 7
AD3_AIN2: C69.1 C75.2 R50.1 ; also sheet 7
AD3_AIN3: K24.4 ; also sheet 7
AD3_AIN4: C70.2 C73.1 R51.1 ; also sheet 7
AD3_AIN5: C70.1 C76.2 R52.1 ; also sheet 7
AD3_AIN6: C71.2 C74.1 R53.1 ; also sheet 7
AD3_AIN7: C71.1 C77.2 R54.1 ; also sheet 7
BIASP_AD1: K17.1 K18.1 K19.1 ; also sheet 7
BIASP_AD2: K20.1 K21.1 K22.1 ; also sheet 7
BIASP_AD3: K23.1 K24.1 K25.1 ; also sheet 7
GND: C54.2 C55.2 C56.2 C57.1 C58.1 C59.1 C63.2 C64.2 C65.2 C66.1 C67.1 C68.1 C72.2 C73.2 C74.2 C75.1 C76.1 C77.1 ; also sheet 1,2,3,4,5,6,7,9,10
IEXC1_AD1: K19.4 ; also sheet 7
IEXC1_AD2: K22.4 ; also sheet 7
IEXC1_AD3: K25.4 ; also sheet 7
N$20: K18.3 R39.2
N$22: K18.2 R40.2
N$23: K17.3 R37.2
N$27: K17.2 R38.2
N$28: K19.3 R41.2
N$31: K19.2 R42.2
N$34: K20.3 R43.2
N$35: K20.2 R44.2
N$42: K21.3 R45.2
N$43: K21.2 R46.2
N$44: K22.3 R47.2
N$45: K22.2 R48.2
N$46: K23.3 R49.2
N$48: K23.2 R50.2
N$49: K24.3 R51.2
N$50: K24.2 R52.2
N$51: K25.3 R53.2
N$52: K25.2 R54.2

### Notes on the sheet
- RTD input filters

## Sheet 9 of 10: RS485
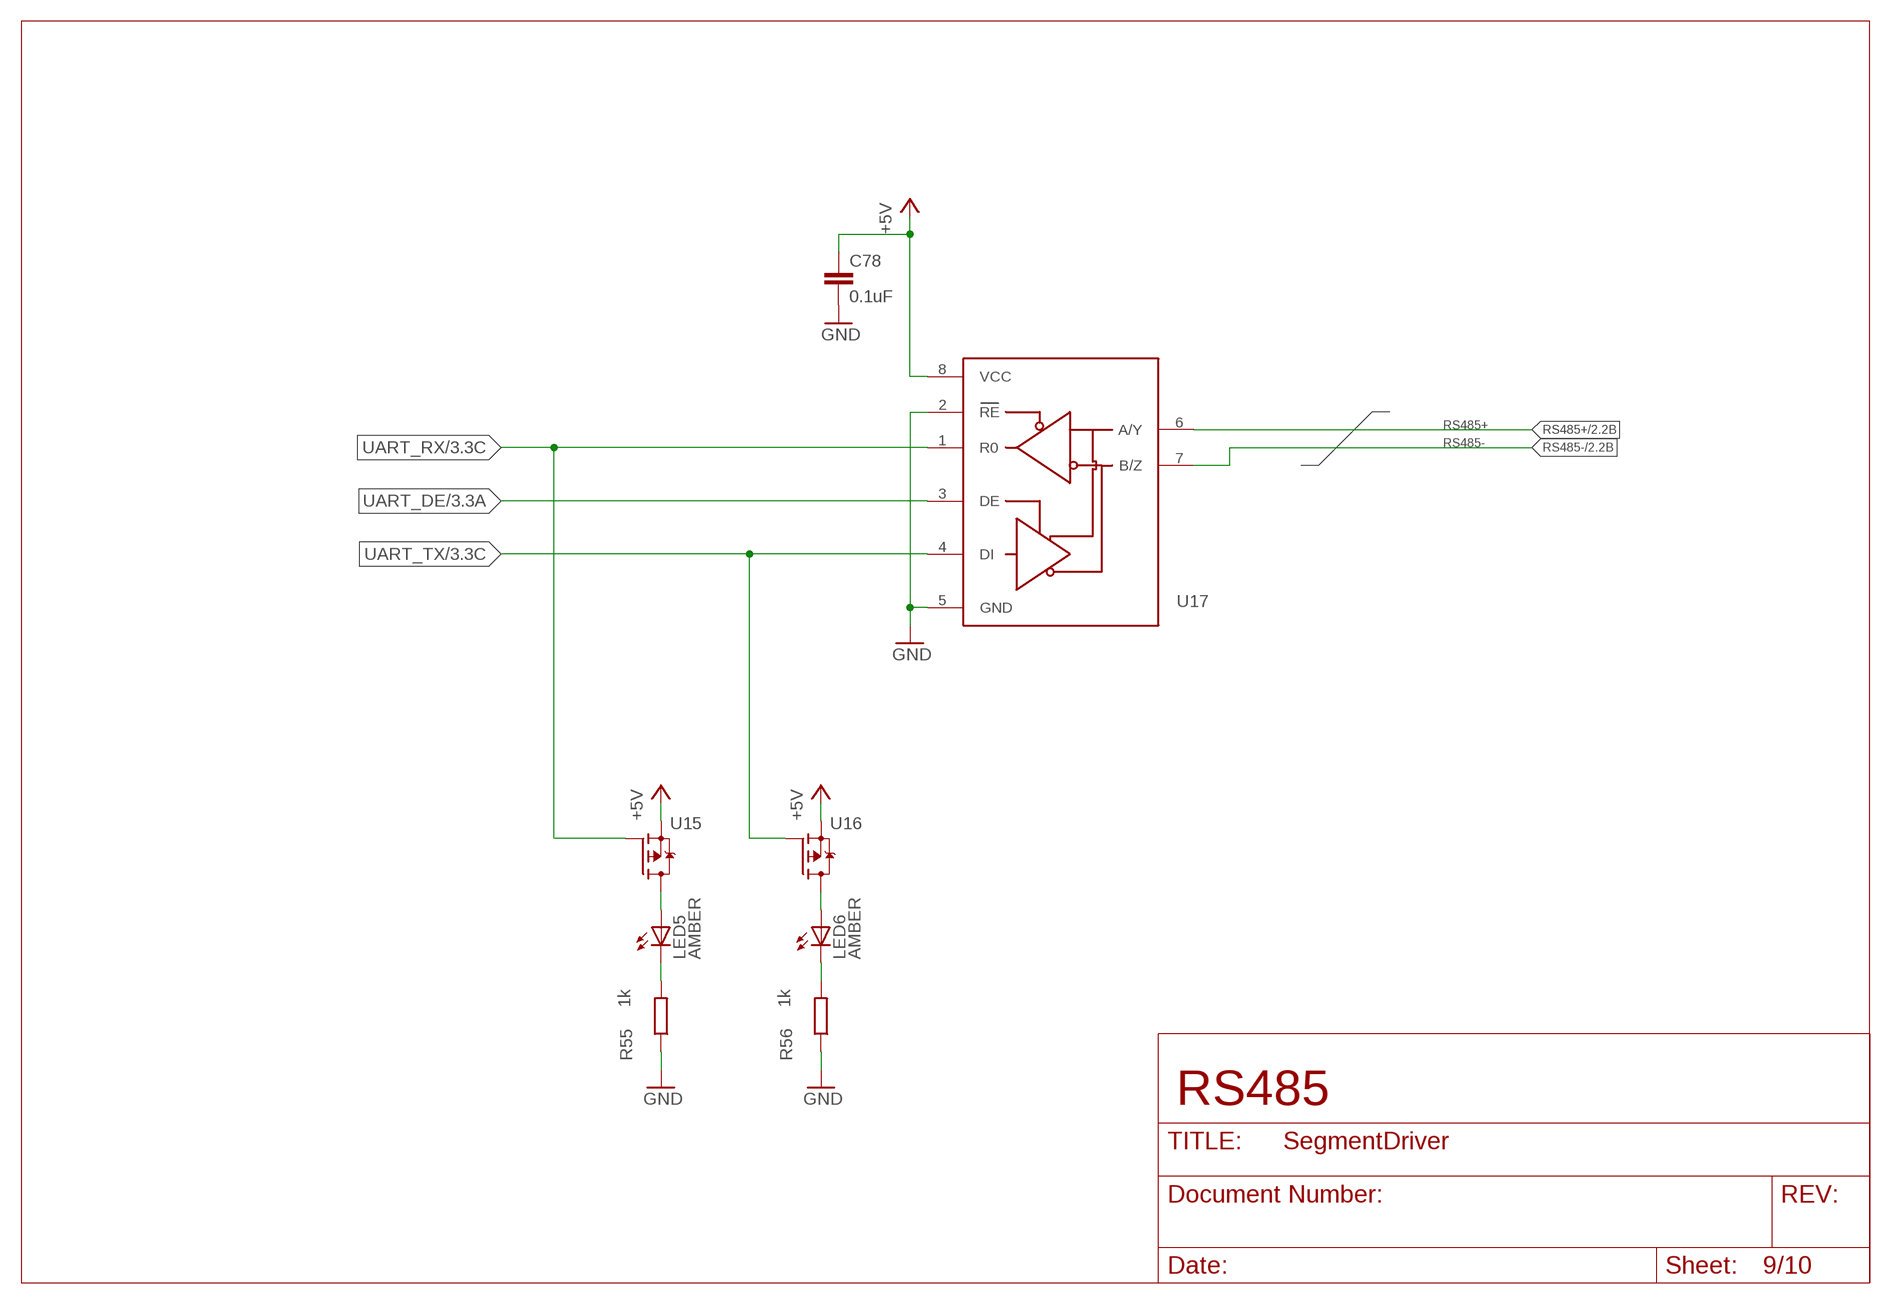
[diagram p8: schematic, sheet 9]

### Parts
C78  0.1uF  C-EUC0603K  [C0603K]
LED5  AMBER  LEDCHIPLED_0603  [CHIPLED_0603]
LED6  AMBER  LEDCHIPLED_0603  [CHIPLED_0603]
R55  1k  R-EU_R0603  [R0603]
R56  1k  R-EU_R0603  [R0603]
U15  DMP2215L-7  [SOT95P240X110-3N]
U16  DMP2215L-7  [SOT95P240X110-3N]
U17  ISL83078E  [SOIC08]

### Nets
+5V: C78.1 U15.2(S) U16.2(S) U17.8(VCC) ; also sheet 1,2,5,10
GND: C78.2 R55.1 R56.1 U17.2(RE) U17.5(GND) ; also sheet 1,2,3,4,5,6,7,8,10
N$25: LED5.C R55.2
N$26: LED6.C R56.2
N$60: LED5.A U15.3(D)
N$61: LED6.A U16.3(D)
RS485+: U17.6(A/Y) ; also sheet 2
RS485-: U17.7(B/Z) ; also sheet 2
UART_DE: U17.3(DE) ; also sheet 3
UART_RX: U15.1(G) U17.1(R0) ; also sheet 3
UART_TX: U16.1(G) U17.4(DI) ; also sheet 3

### Notes on the sheet
- RS485

## Sheet 10 of 10
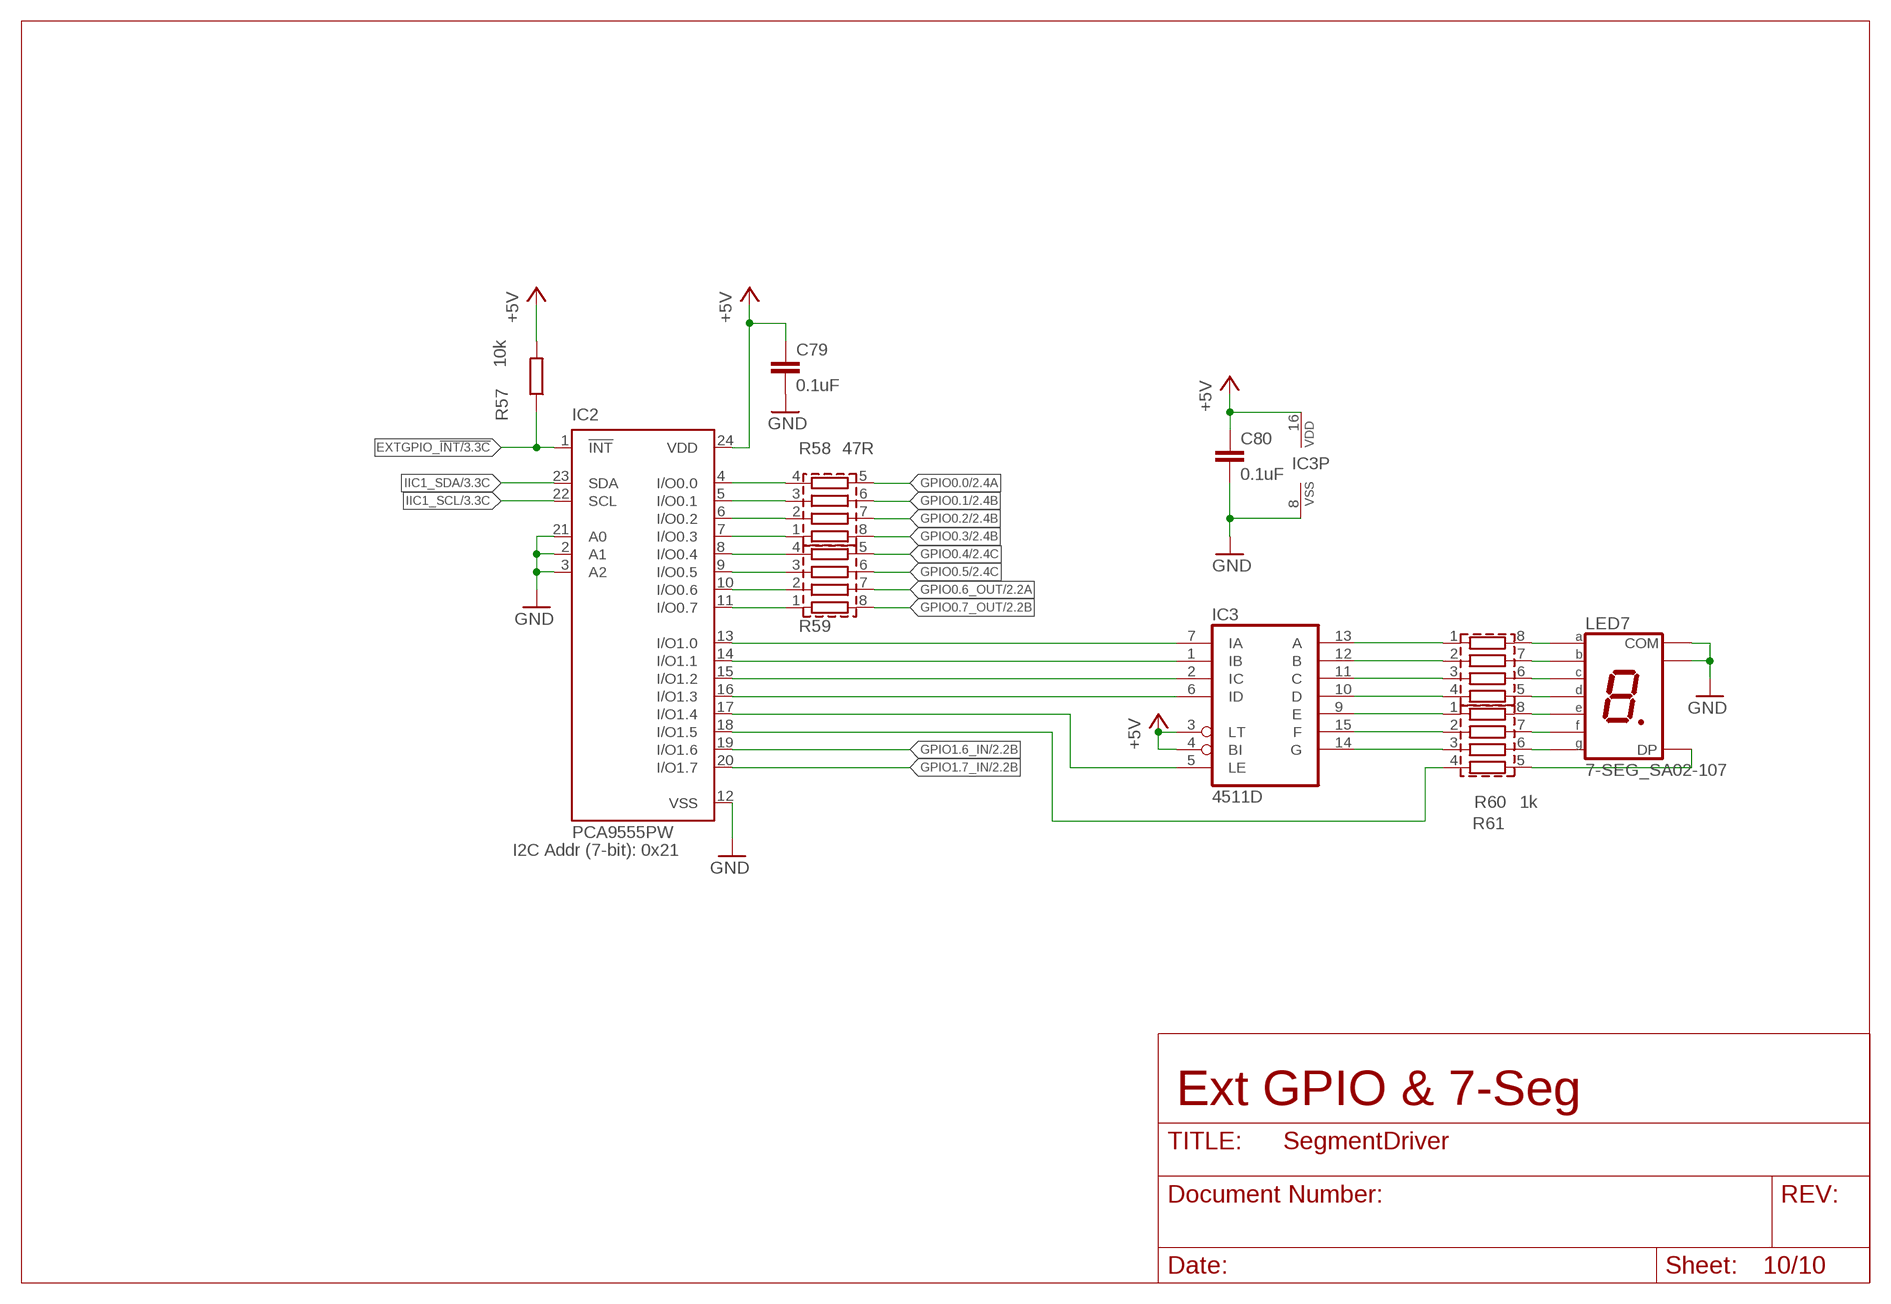
[diagram p9: schematic, sheet 10]

### Parts
C79  0.1uF  C-EUC0603K  [C0603K]
C80  0.1uF  C-EUC0603K  [C0603K]
IC2  PCA9555PW  [TSSOP24]
IC3  4511D  [SO16]
LED7  7-SEG_SA02-107  [SA02107]
R57  10k  R-EU_R0603  [R0603]
R58  47R  EXBV8V330JV  [RESCAV80P320X160X70-8N]
R59  47R  EXBV8V330JV  [RESCAV80P320X160X70-8N]
R60  47R  EXBV8V330JV  [RESCAV80P320X160X70-8N]
R61  1k  EXBV8V330JV  [RESCAV80P320X160X70-8N]

### Nets
+5V: C79.1 C80.1 IC2.24(VDD) IC3.3(LT) IC3.4(BI) IC3.16(VDD) R57.2 ; also sheet 1,2,5,9
EXTGPIO_!INT: IC2.1(!INT) R57.1 ; also sheet 3
GND: C79.2 C80.2 IC2.2(A1) IC2.3(A2) IC2.12(VSS) IC2.21(A0) IC3.8(VSS) LED7.COM@3(COM) LED7.COM@8(COM) ; also sheet 1,2,3,4,5,6,7,8,9
GPIO0.0: R58.5 ; also sheet 2
GPIO0.1: R58.6 ; also sheet 2
GPIO0.2: R58.7 ; also sheet 2
GPIO0.3: R58.8 ; also sheet 2
GPIO0.4: R59.5 ; also sheet 2
GPIO0.5: R59.6 ; also sheet 2
GPIO0.6_OUT: R59.7 ; also sheet 2
GPIO0.7_OUT: R59.8 ; also sheet 2
GPIO1.6_IN: IC2.19(I/O1.6) ; also sheet 2
GPIO1.7_IN: IC2.20(I/O1.7) ; also sheet 2
IIC1_SCL: IC2.22(SCL) ; also sheet 3,4,5
IIC1_SDA: IC2.23(SDA) ; also sheet 3,4,5
N$30: IC2.4(I/O0.0) R58.4
N$36: IC2.5(I/O0.1) R58.3
N$37: IC2.6(I/O0.2) R58.2
N$38: IC2.7(I/O0.3) R58.1
N$41: IC2.8(I/O0.4) R59.4
N$53: IC2.9(I/O0.5) R59.3
N$54: IC2.10(I/O0.6) R59.2
N$55: IC2.11(I/O0.7) R59.1
N$88: IC2.13(I/O1.0) IC3.7(IA)
N$89: IC3.13(A) R60.1
N$90: IC3.12(B) R60.2
N$91: IC3.11(C) R60.3
N$92: IC3.10(D) R60.4
N$93: IC3.9(E) R61.1
N$94: IC3.15(F) R61.2
N$95: IC3.14(G) R61.3
N$96: LED7.A@7(A) R60.8
N$97: LED7.B@6(B) R60.7
N$98: LED7.C@4(C) R60.6
N$99: LED7.D@2(D) R60.5
N$100: LED7.E@1(E) R61.8
N$101: LED7.F@9(F) R61.7
N$102: LED7.G@10(G) R61.6
N$103: LED7.DP@5(DP) R61.5
N$104: IC2.14(I/O1.1) IC3.1(IB)
N$105: IC2.15(I/O1.2) IC3.2(IC)
N$106: IC2.16(I/O1.3) IC3.6(ID)
N$107: IC2.17(I/O1.4) IC3.5(LE)
N$108: IC2.18(I/O1.5) R61.4

### Notes on the sheet
- I2C Addr (7-bit): 0x21
- Ext GPIO & 7-Seg

## Library data of the parts
$2_206_$_2016-11-07_20-18-07 H6 H7 = simbits:MOUNT-HOLE: MOUNTING HOLE with drill center marker
BAT1 = simbits:BATTERY: Battery Holders Various common sizes : AA, AAA, 20mm coin cell and 12mm coin cell. 20MM_4LEGS, BATT-10373; DIGIKEY: BK-912-CT-ND
C1 C3 = Panasonic-EEEFK_EEEFP:EEE-: Aluminum Electrolytic Capacitors,Surface Mount Type; MPN: EEE-FK1J471AM; OC_FARNELL: 2284670; OC_NEWARK: 53W3682; PACKAGE: CASE-J16; SUPPLIER: PANASONIC; TOLERANCE: ±20 %; VOLTAGERATING: 63V
C2 C4 = Panasonic-EEEFK_EEEFP:EEE-: Aluminum Electrolytic Capacitors,Surface Mount Type; MPN: EEE-FP1V221AP; OC_FARNELL: 1539514; OC_NEWARK: 94M7043; PACKAGE: CASE-F; SUPPLIER: PANASONIC; TOLERANCE: ±20 %; VOLTAGERATING: 35V
C5-C23 C33-C91 = rcl:C-EU: CAPACITOR, European symbol
C24-C32 = Panasonic-EEEFK_EEEFP:EEE-: Aluminum Electrolytic Capacitors,Surface Mount Type; MPN: EEE-FK1J221AQ; OC_FARNELL: 2284669; OC_NEWARK: 53W3681; PACKAGE: CASE-H13; SUPPLIER: PANASONIC; TOLERANCE: ±20 %; VOLTAGERATING: 63V
H1-H5 = simbits:MOUNT-PAD-ROUND: MOUNTING PAD, round
IC1 = atmel:ATMEGA644: 8-bit Microcontroller with 64K Bytes In-System Programmable Flash Source: http://www.atmel.com/dyn/resources/prod_documents/doc2593.pdf; MPN: ATMEGA644PV-10AU; OC_FARNELL: 1455123; OC_NEWARK: 58M3748
IC2 = micro-philips:PCA9555: 16-bit I2C and SMBus I/O port with interrupt Source: PCA9555_5.pdf; MPN: PCA9555PW; OC_FARNELL: 1408297; OC_NEWARK: 63K6069
IC3 = 45xx:4511: BCD to 7-segment LATCH/DECODER/DRIVER
JP1 = SparkFun-Connectors:M03X2: 2x3 .1" header. Shrouded, with keying- CONN-10681 SMT- CONN-11415 Pogo pins- HW-11044
K1 K2 = Wurth_Elektronik_Electromechanic_Terminal_Blocks_Connectors_rev15d:691313710002: WR-TBL Serie 3137 - 5.0mm Close Horizontal PCB Header , 2 Pins=>Code : Con_TBL_Pluggable_5.00_PCB_H_691313710002 <http://katalog.we-online.de/media/images/eican/Con_TBL_Pluggable_5.00_PCB_H_6913137100xx_pf2.jpg> Details see: http://katalog.we-online.de/en/em/691_313_710_0xx Created 2014-06-19, Karrer Zheng 2014 (C) Würth Elektronik
K3 K4 = Wurth_Elektronik_Electromechanic_Terminal_Blocks_Connectors_rev15d:691322310002: WR-TBL Serie 322 - 3.81mm Vertical PCB Header , 2 Pins=>Code : Con_TBL_Pluggable_3.81_PCB_THT_Simple_691322310002 <http://katalog.we-online.de/media/images/eican/Con_TBL_Pluggable_3.81_PCB_THT_Simple_6913223100xx_pf2.jpg> Details see: http://katalog.we-online.de/en/em/691_322_310_0xx Created 2014-06-19, Karrer Zheng 2014 (C) Würth Elektronik
K5 = Wurth_Elektronik_Electromechanic_Input-Output_Connectors_rev15c:615016149521: WR-MJ_Modular Jack_Tab UP_8P8C_Assembly1x2 8P8C Tab UP_Pre-Assembly 1x2 Details see: Created 2014-10-16, Aslant Tao 2014 (C) Würth Elektronik
K6 = Wire-to-Board:61200621621: WR-BHD 2.54mm Male Box Header, 6 Pins=>Code : Con_WTB_BHD_2.54_Male_THT_WS_61200621621 <http://katalog.we-online.de/media/thumbs2/eican/thb_Con_WTB_BHD_2.54_Male_THT_WS_6120xx21621_pf2.jpg> Details see: http://katalog.we-online.de/en/em/612_0xx_216_21 Created 2014-06-04, Karrer Zheng 2014 (C) Würth Elektronik
K7 = Wire-to-Board:61201021621: WR-BHD 2.54mm Male Box Header, 10 Pins=>Code : Con_WTB_BHD_2.54_Male_THT_WS_61201021621 <http://katalog.we-online.de/media/thumbs2/eican/thb_Con_WTB_BHD_2.54_Male_THT_WS_6120xx21621_pf2.jpg> Details see: http://katalog.we-online.de/en/em/612_0xx_216_21 Created 2014-06-04, Karrer Zheng 2014 (C) Würth Elektronik
K8-K16 = simbits:M02: Standard 2-pin 0.1" header. Use with - straight break away headers ( PRT-00116) - right angle break away headers (PRT-00553) - swiss pins (PRT-00743) - machine pins (PRT-00117) - female headers (PRT-00115) Molex polarized connector foot print use with: PRT-08233 with associated crimp pins and housings. 2.54_SCREWTERM for use with PRT-10571. 3.5mm Screw Terminal footprints for PRT-08084 5mm Screw Terminal footprints for use with PRT-08432
K17-K25 = Wurth_Elektronik_Electromechanic_Terminal_Blocks_Connectors_rev15d:691210910004: WR-TBL Serie 2109 - 2.54mm Horizontal Entry Modular with Rising Cage Clamp - 0.8mm2 Wires, 4 Pins=>Code : Con_TBL_Screw_RisingClamp_2.54_691210910004 <http://katalog.we-online.de/media/images/eican/Con_TBL_Screw_RisingClamp_2.54_6912109100xx_pf2.jpg> Details see: http://katalog.we-online.de/en/em/691_210_910_0xx Created 2014-06-18, Karrer Zheng 2014 (C) Würth Elektronik
LED1-LED6 = adafruit:LED: LED OSRAM: - CHIPLED LG R971, LG N971, LY N971, LG Q971, LY Q971, LO R971, LY R971 LH N974, LH R974 LS Q976, LO Q976, LY Q976 LO Q996 - Hyper CHIPLED LW Q18S LB Q993, LB Q99A, LB R99A - SideLED LS A670, LO A670, LY A670, LG A670, LP A670 LB A673, LV A673, LT A673, LW A673 LH A674 LY A675 LS A676, LA A676, LO A676, LY A676, LW A676 LS A679, LY A679, LG A679 - Hyper Micro SIDELED® LS Y876, LA Y876, LO Y876, LY Y876 LT Y87S - SmartLED LW L88C, LW L88S LB L89C, LB L89S, LG L890 LS L89K, LO L89K, LY L89K LS L896, LA L896, LO L896, LY L896 - TOPLED LS T670, LO T670, LY T670, LG T670, LP T670 LSG T670, LSP T670, LSY T670, LOP T670, LYG T670 LG T671, LOG T671, LSG T671 LB T673, LV T673, LT T673, LW T673 LH T674 LS T676, LA T676, LO T676, LY T676, LB T676, LH T676, LSB T676, LW T676 LB T67C, LV T67C, LT T67C, LS T67K, LO T67K, LY T67K, LW E67C LS E67B, LA E67B, LO E67B, LY E67B, LB E67C, LV E67C, LT E67C LW T67C LS T679, LY T679, LG T679 LS T770, LO T770, LY T770, LG T770, LP T770 LB T773, LV T773, LT T773, LW T773 LH T774 LS E675, LA E675, LY E675, LS T675 LS T776, LA T776, LO T776, LY T776, LB T776 LHGB T686 LT T68C, LB T68C - Hyper Mini TOPLED® LB M676 - Mini TOPLED Santana® LG M470 LS M47K, LO M47K, LY M47K Source: http://www.osram.convergy.de/
LED7 = display-kingbright-2:7-SEG_: Kingbright 14.2mm (0.56 INCH) SINGLE DIGIT NUMERIC DUISPLAY Source: SA56-11EWA(Ver1189471036.pdf
Q1-Q9 = simbits:MOSFET-NCHANNEL: Common NMOSFET Parts MFG P/N Store ID Prod ID FDD8780 TRANS-09984 SI7820DN TRANS-11055 FDS6630A IC-08089 2N7002PW TRANS-11151 FQP30N06L COM-10213 TRANS-10060 BSS123LT1G TRANS-08345 BSS138 TRANS-00830 BS170 2N7000
R1-R21 R28-R57 R62-R89 = rcl:R-EU_: RESISTOR, European symbol
R22-R27 = simbits:EXBV8V: Chip Resistor Array; MPN: EXBV8V470JV; OC_FARNELL: 2060153; OC_NEWARK: 65T9009; PACKAGE: 0603; POWERRATING: 0.063 W/element; SUPPLIER: PANASONIC; TOLERANCE: ±5 %
R58 R59 = simbits:EXBV8V: Chip Resistor Array; MPN: EXBV8V470JV; OC_FARNELL: 2060153; OC_NEWARK: 65T9009; PACKAGE: 0603; POWERRATING: 0.063 W/element; SUPPLIER: PANASONIC; TOLERANCE: ±5 %; VALUE: 33R
R60 R61 = simbits:EXBV8V: Chip Resistor Array; MPN: EXBV8V102JV; OC_FARNELL: 2060153; OC_NEWARK: 65T9009; PACKAGE: 0603; POWERRATING: 0.063 W/element; SUPPLIER: PANASONIC; TOLERANCE: ±5 %; VALUE: 33R
SW1-SW7 = simbits:434153017835: WS-TASV Tact Switch J-Bend SMD version Specification Rating : 50mA, 12VDC Contact Resistance Initial: 100mΩ max. After life test:1mΩ max. Insulation Resistance: min.100MΩ at 500VDC Dielectric Strength : 250VAC for 1 minute Stroke:0.15±0.1mm Bounce :10ms max. Material Cover : : Stainless steel Stem :LCP UL 94 V-0. FramePA46 UL HB, color Black >Contact : Stainless Steel with Silver Tape:Polyimide tape Terminal : Copper Alloy with Silver <http://katalog.we-online.de/media/images/v2/WS-TASU_434331013822_a_4C.jpg> Details see: http://katalog.we-online.de/en/em/TASV_3_5X2_9_SMD_J-BEND?sid=d553d9ab8e 2015 (C) Würth Elektronik
U1 = SparkFun-FreqCtrl:DS1307: I2C real-time clock with battery backup.; PROD_ID: IC-08138
U2 = adafruit:PCA9685: PCA9685 - 16 Channel 12-Bit I2C PWM Controller 5.0V tolerant 16 channel, 12-bit I2C PWM controller with 25mA per output (max. 400mA total) Digikey: 568-5931-1-ND
U3-U11 = simbits:FOD8321: Fairchild FOD8321 2.5A Output Current, Gate Drive Optocoupler in Optoplanar® Wide Body SOP 5-Pin Push-Pull output
U12-U14 = simbits:ADS1X48: ADS1X48 Analog-To-Digital converter with programmable gain amplifier (PGA) for sensor measurment ADS1148IPW 16bit TTSOP28 ADS1148IRHB 16bit VQFN32 ADS1248IPW 24bit TTSOP28 datasheet: http://www.ti.com/lit/ds/symlink/ads1248.pdf
U15 U16 = simbits:DMP2215L-7: P-CHANNEL ENHANCEMENT MODE FIELD EFFECT TRANSISTOR; MPN: DMP2215L-7; OC_FARNELL: 1713864; OC_NEWARK: 25R4539; PACKAGE: SOT-23-3; SUPPLIER: Diodes Inc
U17 = LINE_DRIVERS:ISL83078E
U18 U20 = simbits:78XX; MOUSER_OC: 595-UA7808CKTTR; MPN: UA7808CKTTR; OC_FARNELL: -
U19 = simbits:ADP3333: ADP3333 High Accuracy Ultralow IQ, 300 mA, anyCAP Low Dropout Regulator Datasheet: http://www.mouser.com/ds/2/609/ADP3333-878831.pdf; MOUSER_OC: 584-ADP3333ARMZ-5-R7
X1-X6 = con-molex:53?-03: CONNECTOR wire to board 1.25 mm (.049 inch) pitch header; MF: MOLEX; MPN: 53261-0390; OC_FARNELL: 1125359; OC_NEWARK: 57H5006
Y1 Y2 = SparkFun-FreqCtrl:CRYSTAL: Various standard crystals. Proven footprints. Spark Fun Electronics SKU : COM-00534

## Net classes
2 PWR: drill 0.4 mm